# EAGLE board oresat-camera-card-v0 (EAGLE 9.6.1), part 1 of 3
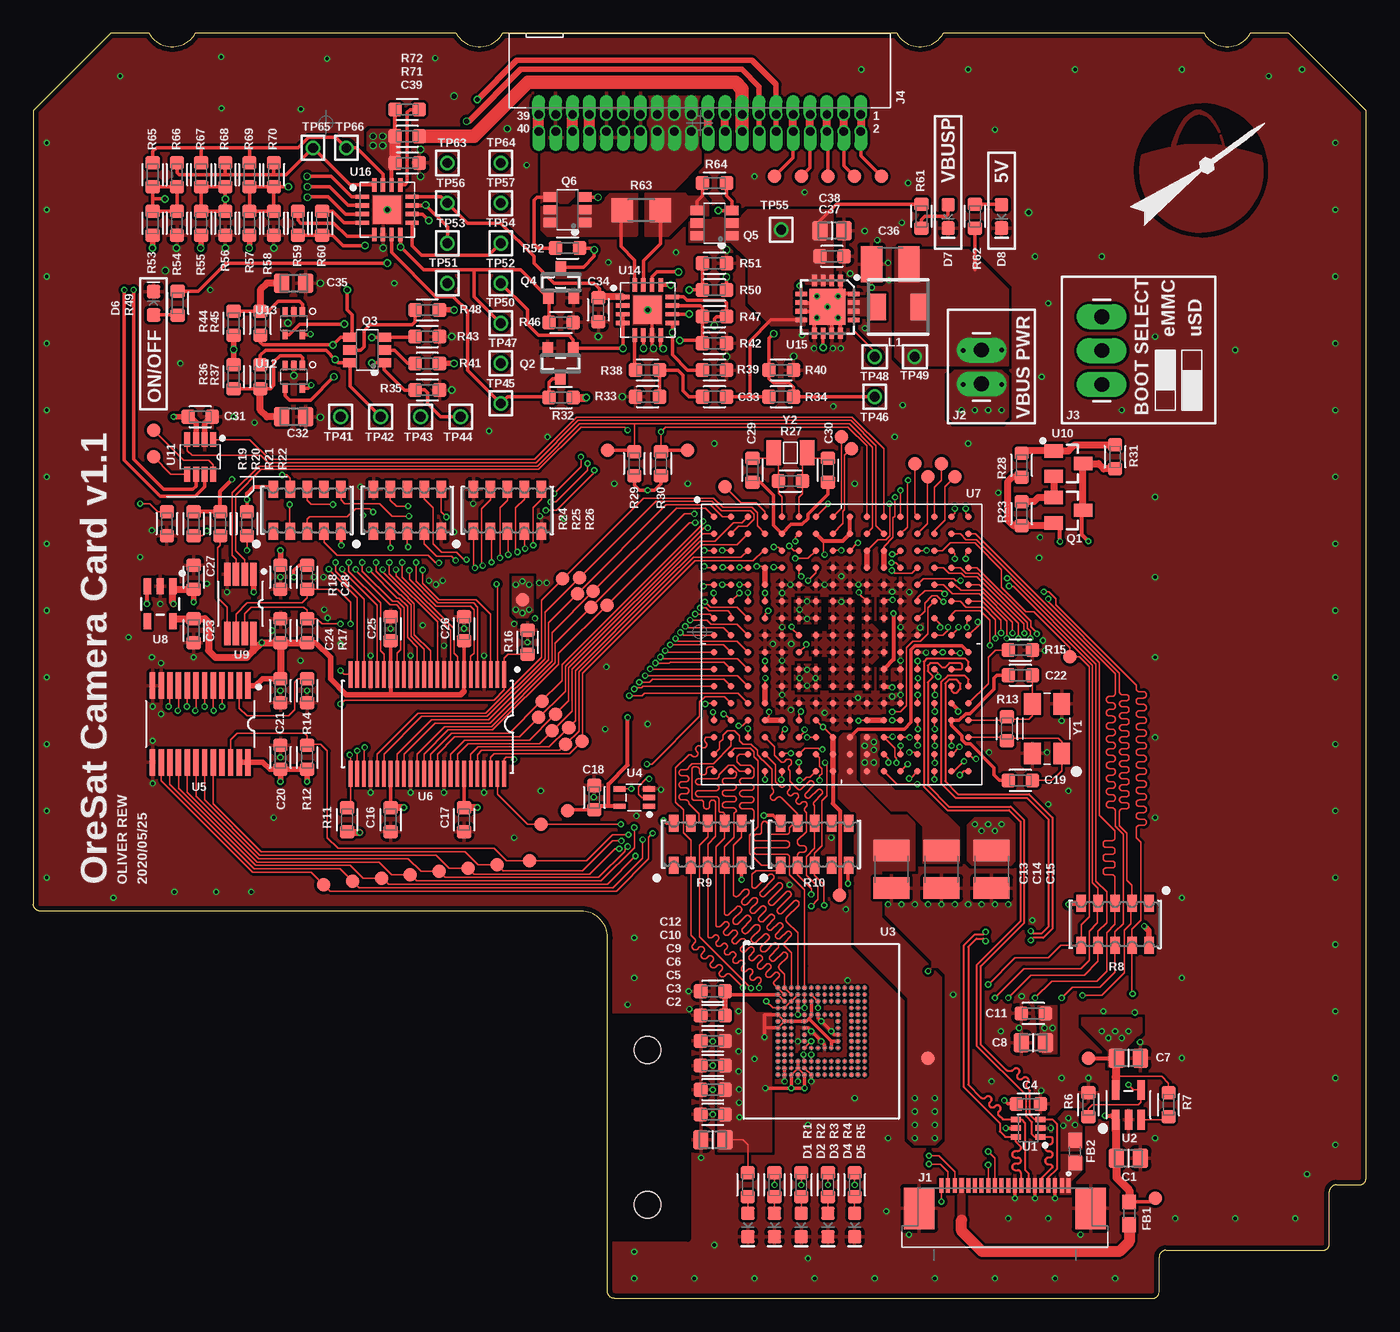
[diagram p9: board, top side]
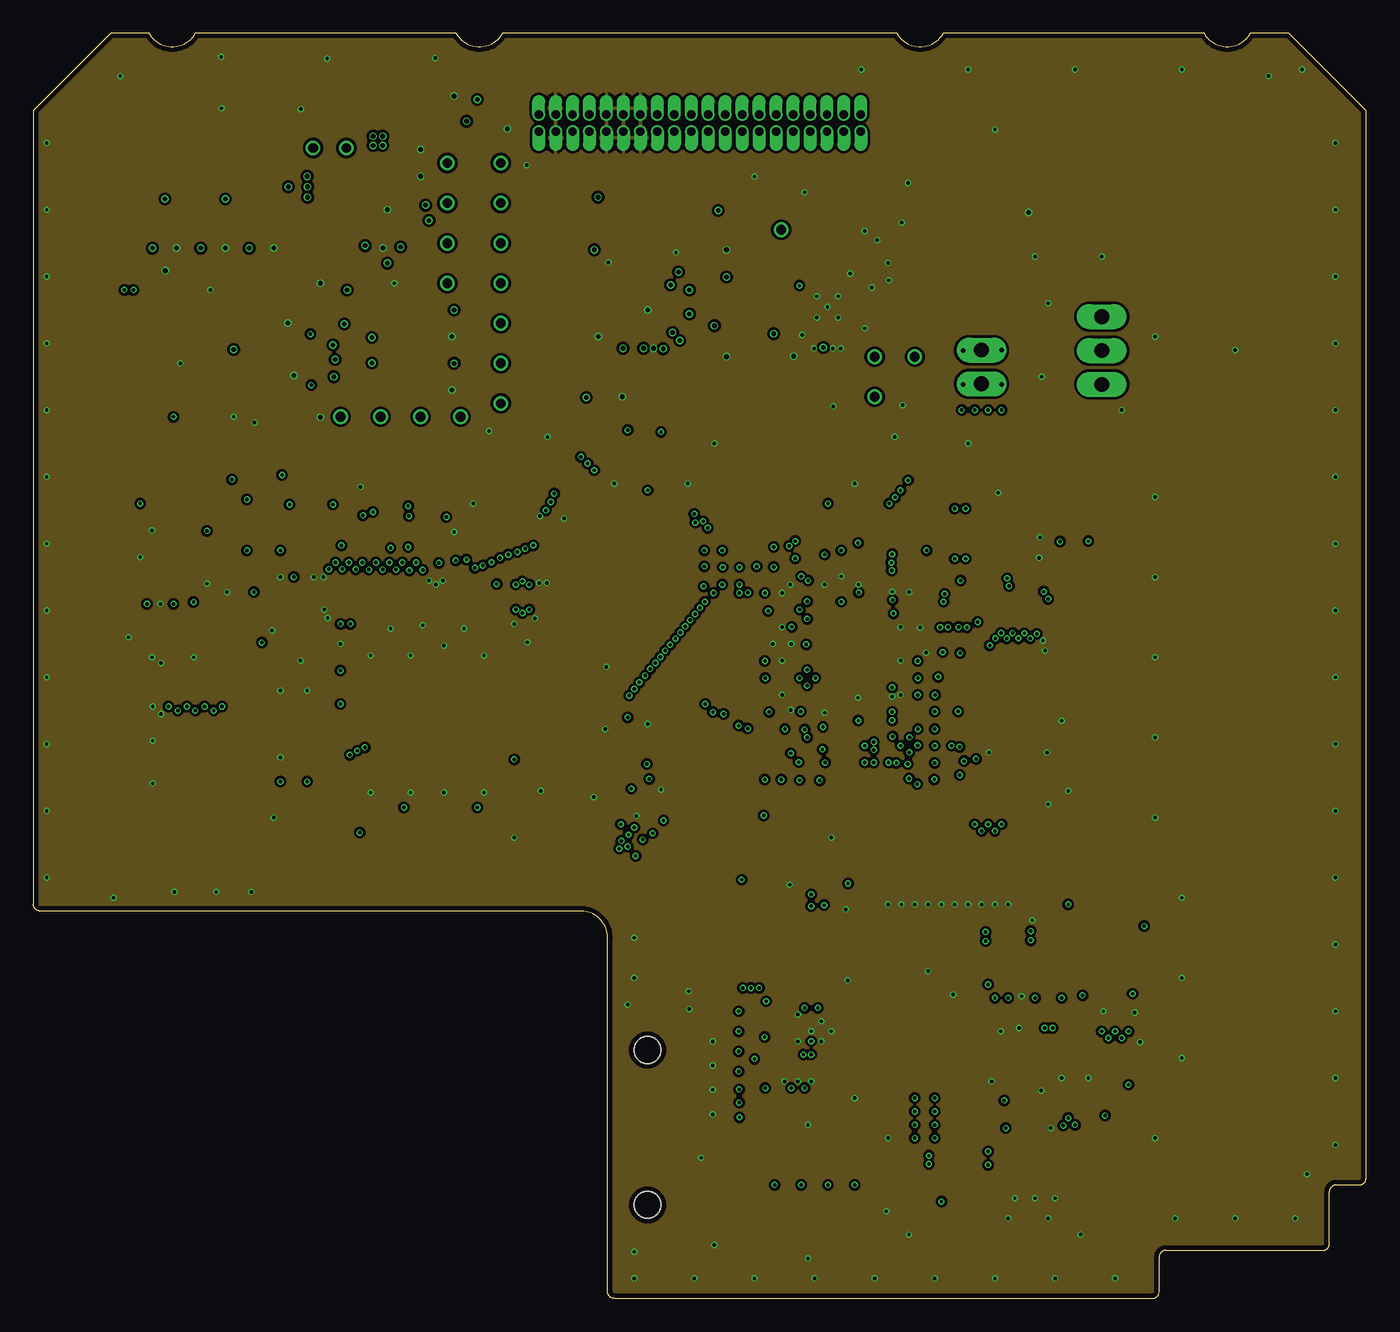
[diagram p10: board, inner layer Route2]
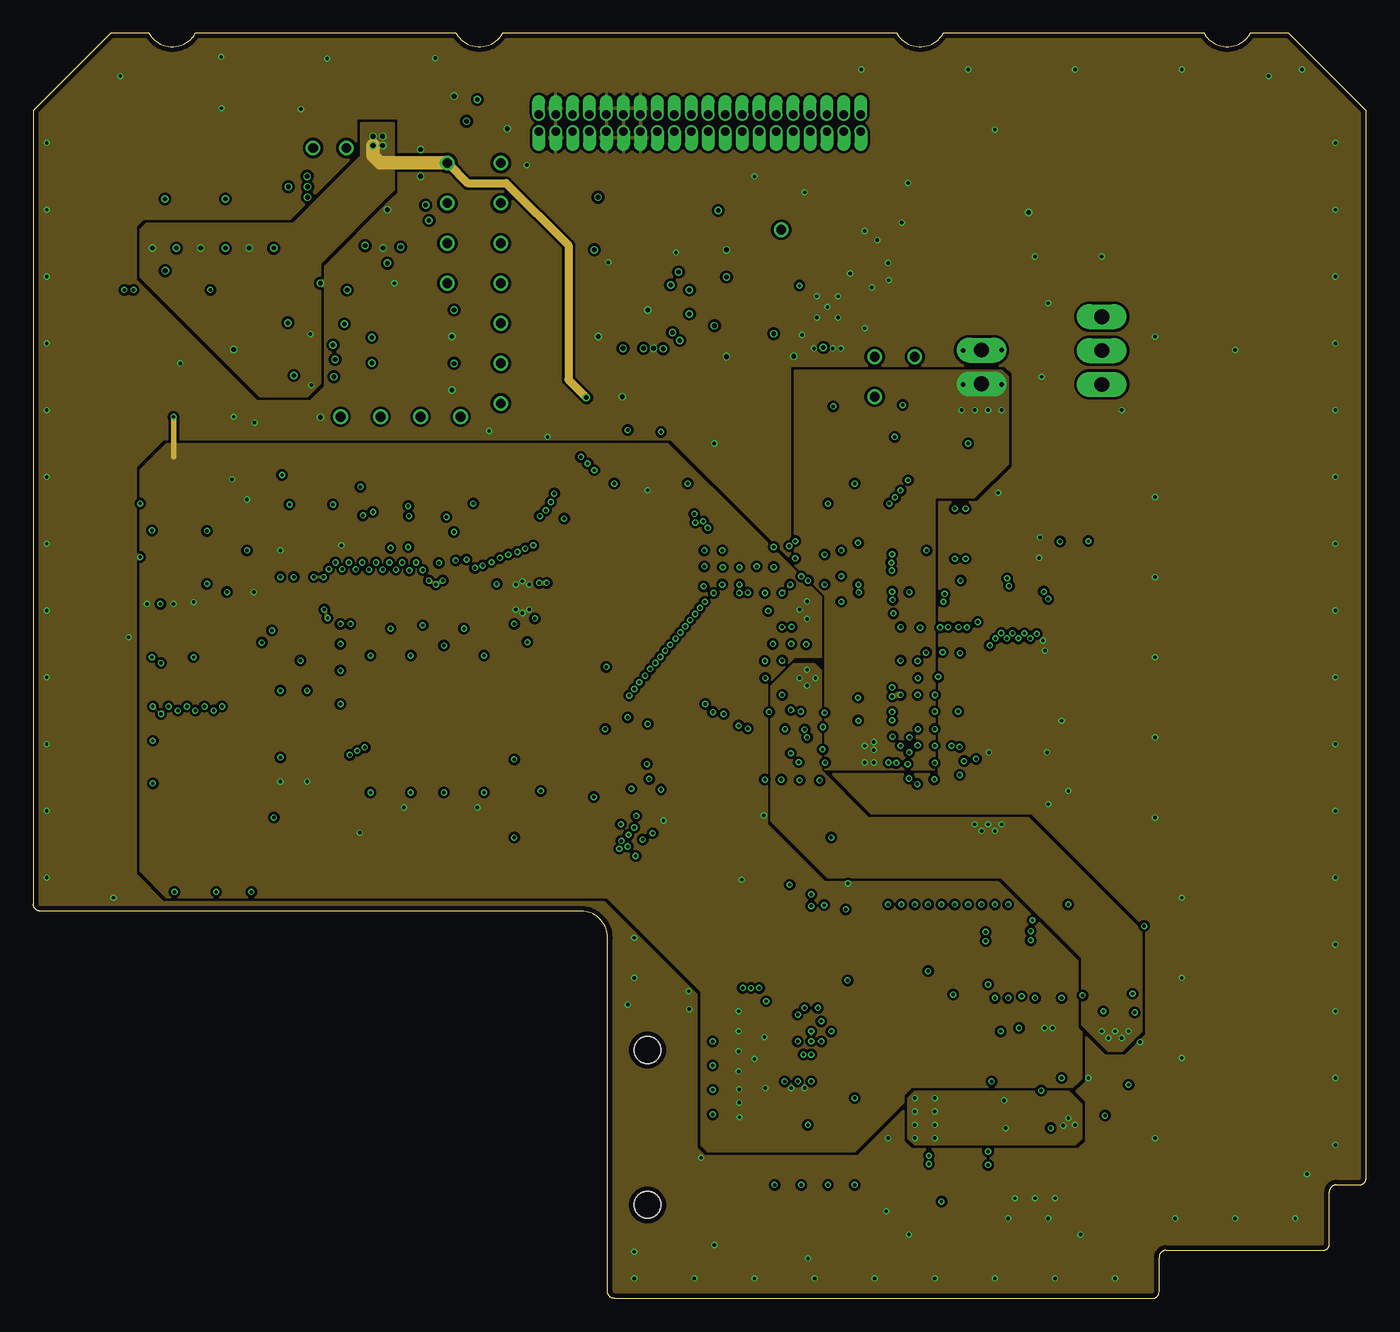
[diagram p11: board, inner layer Route15]
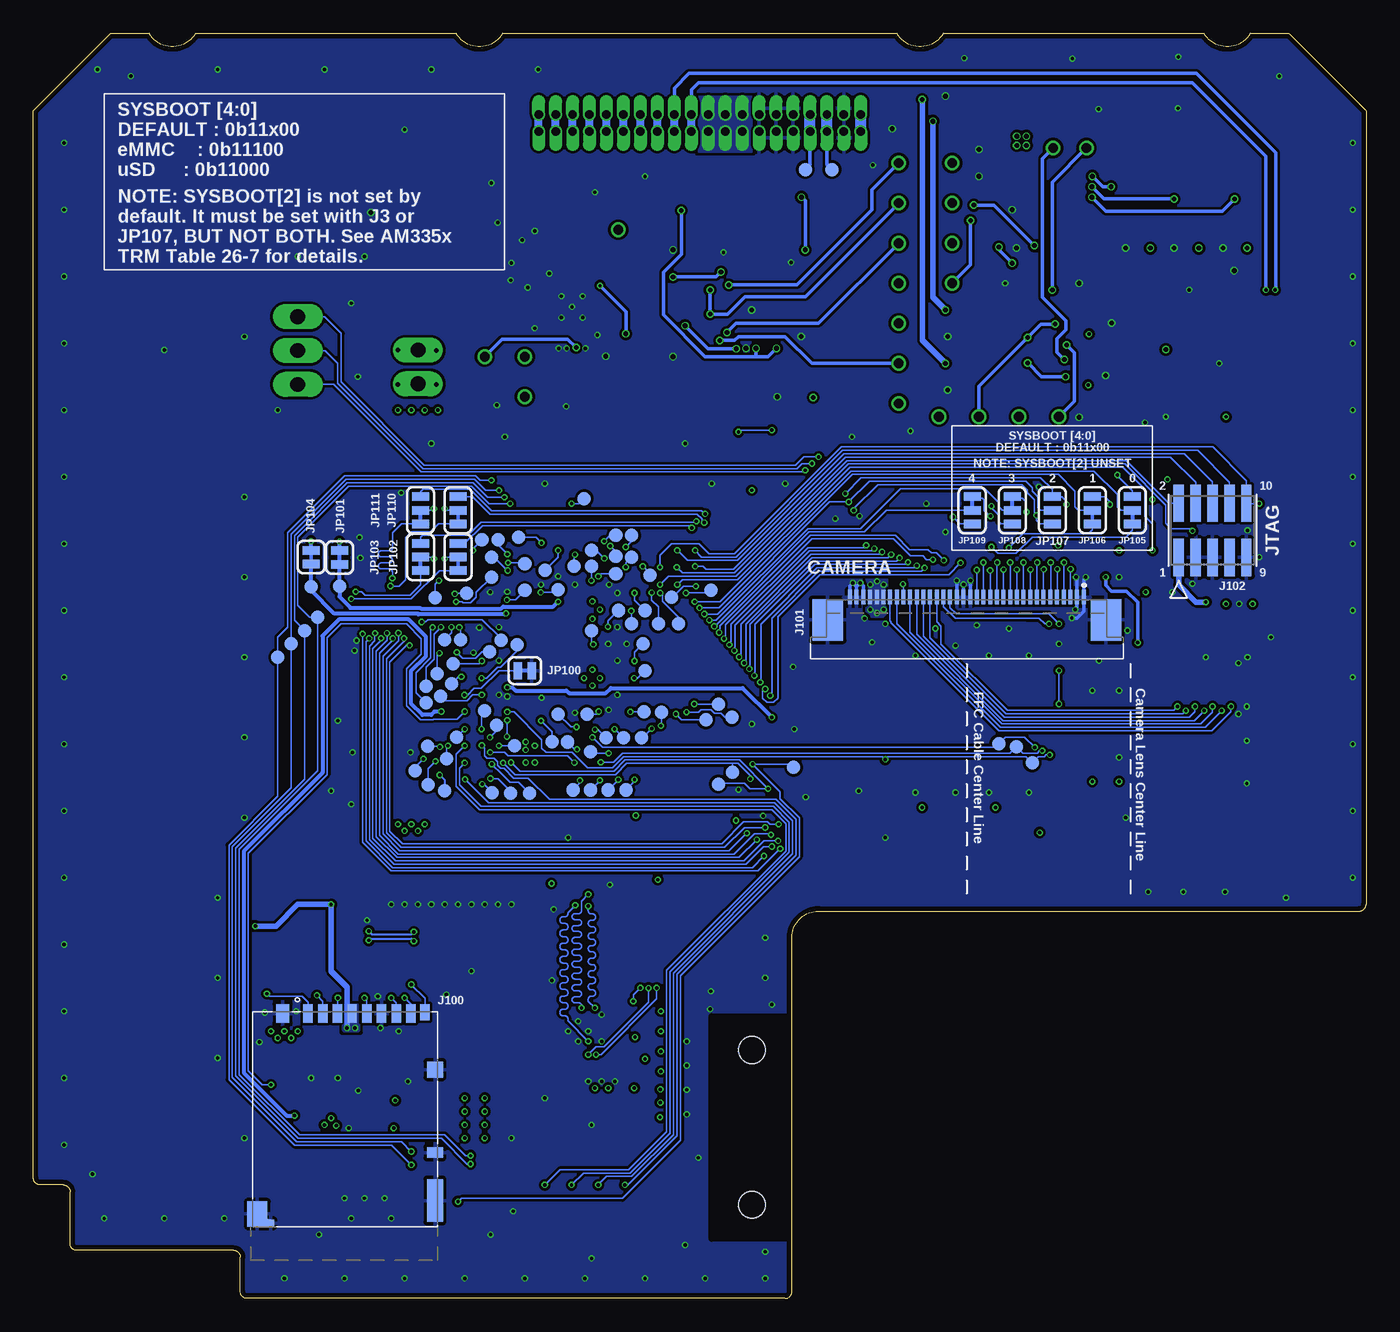
[diagram p12: board, bottom side, seen from below]

Size 99.8 x 94.7 mm. Coordinates in mm from the lower left corner, seen from the top.
Copper layers (1*2*15*16): Top 0.035559375mm / dielectric 0.17018125mm / Route2 0.01778125mm / dielectric 47mil / Route15 0.01778125mm / dielectric 0.17018125mm / Bottom 0.035559375mm
Design rules "4-layer_tented *": minimum track width 5mil, minimum drill 10mil, track to track 5mil, track to pad 5mil, pad to pad 5mil, via to via 5mil, smd to smd 5mil, copper to edge 15mil, drill to drill 6mil, minimum pad ring 4mil, minimum via ring 4mil, stop-mask expansion 2.5mil, vias tented up to drill 20mil, thermal gap 10mil
Net classes: 1 diff pair: width 0.191 mm, clearance 0.191 mm
Holes 2 mm at 46,7 46,18.6
tRestrict: area 43,4.5 to 49,21.1
bRestrict: area 43,4.5 to 49,21.1

## Footprints (pad centres in the part's own frame; a part is rotated, then mirrored left to right if it is on the bottom)
.0805-B = smd 1.15 x 1.45: 1 -0.9,0; 2 0.9,0
.0603-A = smd 1 x 1.05: 1 -0.9,0; 2 0.9,0
C1210 = smd 1.6 x 2.7: 1 -1.4,0; 2 1.4,0
.0805-B-NOSILK = smd 1.15 x 1.45: 1 -0.9,0; 2 0.9,0
LED-0603 = smd 1 x 1: A -0.877,0; C 0.877,0
0603 = smd 1.1 x 1: 1 -0.85,0; 2 0.85,0
TE_2-1734592-0 = smd 0.3 x 1.1: 1 -4.75,-1.7; 2 -4.25,-1.7; 3 -3.75,-1.7; 4 -3.25,-1.7; 5 -2.75,-1.7; 6 -2.25,-1.7; 7 -1.75,-1.7; 8 -1.25,-1.7; 9 -0.75,-1.7; 10 -0.25,-1.7; 11 0.25,-1.7; 12 0.75,-1.7; 13 1.25,-1.7; 14 1.75,-1.7; 15 2.25,-1.7; 16 2.75,-1.7; 17 3.25,-1.7; 18 3.75,-1.7; 19 4.25,-1.7; 20 4.75,-1.7 | smd 2.3 x 3.1: PAD1 6.42,0; PAD2 -6.42,0
1X02_LONGPADS = drill 1.118 pad 1.88 long: 1 0,0; 2 2.54,0
1X03_LONGPADS = drill 1.118 pad 1.88 long: 1 0,0; 2 2.54,0; 3 5.08,0
J-SAMTEC-TFM-120-X1-XXX-D-RA = drill 0.635 pad 0.965 offset: 1 12.065,0.635; 2 12.065,-0.635; 3 10.795,0.635; 4 10.795,-0.635; 5 9.525,0.635; 6 9.525,-0.635; 7 8.255,0.635; 8 8.255,-0.635; 9 6.985,0.635; 10 6.985,-0.635; 11 5.715,0.635; 12 5.715,-0.635; 13 4.445,0.635; 14 4.445,-0.635; 15 3.175,0.635; 16 3.175,-0.635; 17 1.905,0.635; 18 1.905,-0.635; 19 0.635,0.635; 20 0.635,-0.635; 21 -0.635,0.635; 22 -0.635,-0.635; 23 -1.905,0.635; 24 -1.905,-0.635; 25 -3.175,0.635; 26 -3.175,-0.635; 27 -4.445,0.635; 28 -4.445,-0.635; 29 -5.715,0.635; 30 -5.715,-0.635; 31 -6.985,0.635; 32 -6.985,-0.635; 33 -8.255,0.635; 34 -8.255,-0.635; 35 -9.525,0.635; 36 -9.525,-0.635; 37 -10.795,0.635; 38 -10.795,-0.635; 39 -12.065,0.635; 40 -12.065,-0.635
DM3BT-DSF-PEJS = smd 0.7 x 1.4: 1 -3.2,15.95; 2 -2.1,15.95; 3 -1,15.95; 4 0.1,15.95; 5 1.2,15.95; 6 2.3,15.95; 7 3.4,15.95; 8 4.5,15.95 | smd 0.7 x 1.2: CD 5.55,16.05 | smd 0.5 x 0.5: CGND1 -6,0.25 | smd 1.5 x 1.9: CGND2 -7,0.95 | smd 0.21 x 0.21 rotated 45: CGND3 -6.25,0.5 | smd 1 x 1.4: CGND4 -5.1,15.95 | smd 1.2 x 1.2: CGND5 6.3,11.75 | smd 1.2 x 3.2: CGND6 6.3,1.95 | smd 1.2 x 0.8: GND 6.3,5.55
TE_3-1734592-6 = smd 0.3 x 1.1: 1 -8.75,0; 2 -8.25,0; 3 -7.75,0; 4 -7.25,0; 5 -6.75,0; 6 -6.25,0; 7 -5.75,0; 8 -5.25,0; 9 -4.75,0; 10 -4.25,0; 11 -3.75,0; 12 -3.25,0; 13 -2.75,0; 14 -2.25,0; 15 -1.75,0; 16 -1.25,0; 17 -0.75,0; 18 -0.25,0; 19 0.25,0; 20 0.75,0; 21 1.25,0; 22 1.75,0; 23 2.25,0; 24 2.75,0; 25 3.25,0; 26 3.75,0; 27 4.25,0; 28 4.75,0; 29 5.25,0; 30 5.75,0; 31 6.25,0; 32 6.75,0; 33 7.25,0; 34 7.75,0; 35 8.25,0; 36 8.75,0 | smd 2.3 x 3.1: S1 10.42,1.7; S2 -10.42,1.7
CON10_2X5_DUK_FTSH = smd 0.762 x 2.794: 1 -2.54,-2.032; 2 -2.54,2.032; 3 -1.27,-2.032; 4 -1.27,2.032; 5 0,-2.032; 6 0,2.032; 7 1.27,-2.032; 8 1.27,2.032; 9 2.54,-2.032; 10 2.54,2.032
SMT-JUMPER_2_NC_TRACE_SILK = smd 0.635 x 1.27: 1 -0.508,0; 2 0.508,0
SMT-JUMPER_3_1-NC_TRACE_SILK = smd 0.635 x 1.27: 1 -1.016,0; 2 0,0; 3 1.016,0
SMT-JUMPER_3_0-NO_TRACE_NO-SILK = smd 0.635 x 1.27: 1 -1.016,0; 2 0,0; 3 1.016,0
ECS-MPI4040 = smd 2 x 1.3: 1 0,1.575; 2 0,-1.575
SOT23-BEC = smd 1 x 1.4: B -0.95,-1.1; C 0,1.1; E 0.95,-1.1
SOT23 = smd 0.787 x 0.889: 1 -0.953,-1.143; 2 0.953,-1.143; 3 0,1.143
SOT23-6 = smd 0.7 x 1: 1 -0.95,-1.3; 2 0,-1.3; 3 0.95,-1.3; 4 0.95,1.3; 5 0,1.3; 6 -0.95,1.3
ARRAY_EXBA-M = smd 1.27 x 0.711: 1 -1.575,2.54; 2 -1.575,1.27; 3 -1.575,0; 4 -1.575,-1.27; 5 -1.575,-2.54; 6 1.575,-2.54; 7 1.575,-1.27; 8 1.575,0; 9 1.575,1.27; 10 1.575,2.54
R1206 = smd 1.6 x 1.803: 1 -1.422,0; 2 1.422,0
PAD.03X.04 = smd 1.016 x 1.016: P$1 0,0
2MM-TEST-POINT = drill 0.737: 1 0,0
SC70-6 = smd 0.4 x 0.75: 1 -0.65,-0.925; 2 0,-0.925; 3 0.65,-0.925; 4 0.65,0.925; 5 0,0.925; 6 -0.65,0.925
DBV5 = smd 1.473 x 0.559: 1 -1.118,0.95; 2 -1.118,0; 3 -1.118,-0.95; 4 1.118,-0.95; 5 1.118,0.95
BGA-153(11.5X13)(EMMC-BA) = smd 0.28 x 0.28: A1 -3.25,3.25; A2 -2.75,3.25; A3 -2.25,3.25; A4 -1.75,3.25; A5 -1.25,3.25; A6 -0.75,3.25; A7 -0.25,3.25; A8 0.25,3.25; A9 0.75,3.25; A10 1.25,3.25; A11 1.75,3.25; A12 2.25,3.25; A13 2.75,3.25; A14 3.25,3.25; B1 -3.25,2.75; B2 -2.75,2.75; B3 -2.25,2.75; B4 -1.75,2.75; B5 -1.25,2.75; B6 -0.75,2.75; B7 -0.25,2.75; B8 0.25,2.75; B9 0.75,2.75; B10 1.25,2.75; B11 1.75,2.75; B12 2.25,2.75; B13 2.75,2.75; B14 3.25,2.75; C1 -3.25,2.25; C2 -2.75,2.25; C3 -2.25,2.25; C4 -1.75,2.25; C5 -1.25,2.25; C6 -0.75,2.25; C7 -0.25,2.25; C8 0.25,2.25; C9 0.75,2.25; C10 1.25,2.25; C11 1.75,2.25; C12 2.25,2.25; C13 2.75,2.25; C14 3.25,2.25; D1 -3.25,1.75; D2 -2.75,1.75; D3 -2.25,1.75; D4 -1.75,1.75; D12 2.25,1.75; D13 2.75,1.75; D14 3.25,1.75; E1 -3.25,1.25; E2 -2.75,1.25; E3 -2.25,1.25; E5 -1.25,1.25; E6 -0.75,1.25; E7 -0.25,1.25; E8 0.25,1.25; E9 0.75,1.25; E10 1.25,1.25; E12 2.25,1.25; E13 2.75,1.25; E14 3.25,1.25; F1 -3.25,0.75; F2 -2.75,0.75; F3 -2.25,0.75; F5 -1.25,0.75; F10 1.25,0.75; F12 2.25,0.75; F13 2.75,0.75; F14 3.25,0.75; G1 -3.25,0.25; G2 -2.75,0.25; G3 -2.25,0.25; G5 -1.25,0.25; G10 1.25,0.25; G12 2.25,0.25; G13 2.75,0.25; G14 3.25,0.25; H1 -3.25,-0.25; H2 -2.75,-0.25; H3 -2.25,-0.25; H5 -1.25,-0.25; H10 1.25,-0.25; H12 2.25,-0.25; H13 2.75,-0.25; H14 3.25,-0.25; J1 -3.25,-0.75; J2 -2.75,-0.75; J3 -2.25,-0.75; J5 -1.25,-0.75; J10 1.25,-0.75; J12 2.25,-0.75; J13 2.75,-0.75; J14 3.25,-0.75; K1 -3.25,-1.25; K2 -2.75,-1.25; K3 -2.25,-1.25; K5 -1.25,-1.25; K6 -0.75,-1.25; K7 -0.25,-1.25; K8 0.25,-1.25; K9 0.75,-1.25; K10 1.25,-1.25; K12 2.25,-1.25; K13 2.75,-1.25; K14 3.25,-1.25; L1 -3.25,-1.75; L2 -2.75,-1.75; L3 -2.25,-1.75; L12 2.25,-1.75; L13 2.75,-1.75; L14 3.25,-1.75; M1 -3.25,-2.25; M2 -2.75,-2.25; M3 -2.25,-2.25; M4 -1.75,-2.25; M5 -1.25,-2.25; M6 -0.75,-2.25; M7 -0.25,-2.25; M8 0.25,-2.25; M9 0.75,-2.25; M10 1.25,-2.25; M11 1.75,-2.25; M12 2.25,-2.25; M13 2.75,-2.25; M14 3.25,-2.25; N1 -3.25,-2.75; N2 -2.75,-2.75; N3 -2.25,-2.75; N4 -1.75,-2.75; N5 -1.25,-2.75; N6 -0.75,-2.75; N7 -0.25,-2.75; N8 0.25,-2.75; N9 0.75,-2.75; N10 1.25,-2.75; N11 1.75,-2.75; N12 2.25,-2.75; N13 2.75,-2.75; N14 3.25,-2.75; P1 -3.25,-3.25; P2 -2.75,-3.25; P3 -2.25,-3.25; P4 -1.75,-3.25; P5 -1.25,-3.25; P6 -0.75,-3.25; P7 -0.25,-3.25; P8 0.25,-3.25; P9 0.75,-3.25; P10 1.25,-3.25; P11 1.75,-3.25; P12 2.25,-3.25; P13 2.75,-3.25; P14 3.25,-3.25
C70(TI-DCK) = smd 0.4 x 0.9: 1 0.65,1.1; 2 0,1.1; 3 -0.65,1.1; 4 -0.65,-1.1; 5 0.65,-1.1
PW24-M = smd 1.981 x 0.406: 1 -2.87,3.575; 2 -2.87,2.925; 3 -2.87,2.275; 4 -2.87,1.625; 5 -2.87,0.975; 6 -2.87,0.325; 7 -2.87,-0.325; 8 -2.87,-0.975; 9 -2.87,-1.625; 10 -2.87,-2.275; 11 -2.87,-2.925; 12 -2.87,-3.575; 13 2.87,-3.575; 14 2.87,-2.925; 15 2.87,-2.275; 16 2.87,-1.625; 17 2.87,-0.975; 18 2.87,-0.325; 19 2.87,0.325; 20 2.87,0.975; 21 2.87,1.625; 22 2.87,2.275; 23 2.87,2.925; 24 2.87,3.575
DGG48-M = smd 1.981 x 0.279: 1 -3.721,5.75; 2 -3.721,5.25; 3 -3.721,4.75; 4 -3.721,4.25; 5 -3.721,3.75; 6 -3.721,3.25; 7 -3.721,2.75; 8 -3.721,2.25; 9 -3.721,1.75; 10 -3.721,1.25; 11 -3.721,0.75; 12 -3.721,0.25; 13 -3.721,-0.25; 14 -3.721,-0.75; 15 -3.721,-1.25; 16 -3.721,-1.75; 17 -3.721,-2.25; 18 -3.721,-2.75; 19 -3.721,-3.25; 20 -3.721,-3.75; 21 -3.721,-4.25; 22 -3.721,-4.75; 23 -3.721,-5.25; 24 -3.721,-5.75; 25 3.721,-5.75; 26 3.721,-5.25; 27 3.721,-4.75; 28 3.721,-4.25; 29 3.721,-3.75; 30 3.721,-3.25; 31 3.721,-2.75; 32 3.721,-2.25; 33 3.721,-1.75; 34 3.721,-1.25; 35 3.721,-0.75; 36 3.721,-0.25; 37 3.721,0.25; 38 3.721,0.75; 39 3.721,1.25; 40 3.721,1.75; 41 3.721,2.25; 42 3.721,2.75; 43 3.721,3.25; 44 3.721,3.75; 45 3.721,4.25; 46 3.721,4.75; 47 3.721,5.25; 48 3.721,5.75
OSD335X-BGA-256 = smd 0.5 x 0.5: A1 -9.525,-9.525; A2 -9.525,-8.255; A3 -9.525,-6.985; A4 -9.525,-5.715; A5 -9.525,-4.445; A6 -9.525,-3.175; A7 -9.525,-1.905; A8 -9.525,-0.635; A9 -9.525,0.635; A10 -9.525,1.905; A11 -9.525,3.175; A12 -9.525,4.445; A13 -9.525,5.715; A14 -9.525,6.985; A15 -9.525,8.255; A16 -9.525,9.525; B1 -8.255,-9.525; B2 -8.255,-8.255; B3 -8.255,-6.985; B4 -8.255,-5.715; B5 -8.255,-4.445; B6 -8.255,-3.175; B7 -8.255,-1.905; B8 -8.255,-0.635; B9 -8.255,0.635; B10 -8.255,1.905; B11 -8.255,3.175; B12 -8.255,4.445; B13 -8.255,5.715; B14 -8.255,6.985; B15 -8.255,8.255; B16 -8.255,9.525; C1 -6.985,-9.525; C2 -6.985,-8.255; C3 -6.985,-6.985; C4 -6.985,-5.715; C5 -6.985,-4.445; C6 -6.985,-3.175; C7 -6.985,-1.905; C8 -6.985,-0.635; C9 -6.985,0.635; C10 -6.985,1.905; C11 -6.985,3.175; C12 -6.985,4.445; C13 -6.985,5.715; C14 -6.985,6.985; C15 -6.985,8.255; C16 -6.985,9.525; D1 -5.715,-9.525; D2 -5.715,-8.255; D3 -5.715,-6.985; D4 -5.715,-5.715; D5 -5.715,-4.445; D6 -5.715,-3.175; D7 -5.715,-1.905; D8 -5.715,-0.635; D9 -5.715,0.635; D10 -5.715,1.905; D11 -5.715,3.175; D12 -5.715,4.445; D13 -5.715,5.715; D14 -5.715,6.985; D15 -5.715,8.255; D16 -5.715,9.525; E1 -4.445,-9.525; E2 -4.445,-8.255; E3 -4.445,-6.985; E4 -4.445,-5.715; E5 -4.445,-4.445; E6 -4.445,-3.175; E7 -4.445,-1.905; E8 -4.445,-0.635; E9 -4.445,0.635; E10 -4.445,1.905; E11 -4.445,3.175; E12 -4.445,4.445; E13 -4.445,5.715; E14 -4.445,6.985; E15 -4.445,8.255; E16 -4.445,9.525; F1 -3.175,-9.525; F2 -3.175,-8.255; F3 -3.175,-6.985; F4 -3.175,-5.715; F5 -3.175,-4.445; F6 -3.175,-3.175; F7 -3.175,-1.905; F8 -3.175,-0.635; F9 -3.175,0.635; F10 -3.175,1.905; F11 -3.175,3.175; F12 -3.175,4.445; F13 -3.175,5.715; F14 -3.175,6.985; F15 -3.175,8.255; F16 -3.175,9.525; G1 -1.905,-9.525; G2 -1.905,-8.255; G3 -1.905,-6.985; G4 -1.905,-5.715; G5 -1.905,-4.445; G6 -1.905,-3.175; G7 -1.905,-1.905; G8 -1.905,-0.635; G9 -1.905,0.635; G10 -1.905,1.905; G11 -1.905,3.175; G12 -1.905,4.445; G13 -1.905,5.715; G14 -1.905,6.985; G15 -1.905,8.255; G16 -1.905,9.525; H1 -0.635,-9.525; H2 -0.635,-8.255; H3 -0.635,-6.985; H4 -0.635,-5.715; H5 -0.635,-4.445; H6 -0.635,-3.175; H7 -0.635,-1.905; H8 -0.635,-0.635; H9 -0.635,0.635; H10 -0.635,1.905; H11 -0.635,3.175; H12 -0.635,4.445; H13 -0.635,5.715; H14 -0.635,6.985; H15 -0.635,8.255; H16 -0.635,9.525; J1 0.635,-9.525; J2 0.635,-8.255; J3 0.635,-6.985; J4 0.635,-5.715; J5 0.635,-4.445; J6 0.635,-3.175; J7 0.635,-1.905; J8 0.635,-0.635; J9 0.635,0.635; J10 0.635,1.905; J11 0.635,3.175; J12 0.635,4.445; J13 0.635,5.715; J14 0.635,6.985; J15 0.635,8.255; J16 0.635,9.525; K1 1.905,-9.525; K2 1.905,-8.255; K3 1.905,-6.985; K4 1.905,-5.715; K5 1.905,-4.445; K6 1.905,-3.175; K7 1.905,-1.905; K8 1.905,-0.635; K9 1.905,0.635; K10 1.905,1.905; K11 1.905,3.175; K12 1.905,4.445; K13 1.905,5.715; K14 1.905,6.985; K15 1.905,8.255; K16 1.905,9.525; L1 3.175,-9.525; L2 3.175,-8.255; L3 3.175,-6.985; L4 3.175,-5.715; L5 3.175,-4.445; L6 3.175,-3.175; L7 3.175,-1.905; L8 3.175,-0.635; L9 3.175,0.635; L10 3.175,1.905; L11 3.175,3.175; L12 3.175,4.445; L13 3.175,5.715; L14 3.175,6.985; L15 3.175,8.255; L16 3.175,9.525; M1 4.445,-9.525; M2 4.445,-8.255; M3 4.445,-6.985; M4 4.445,-5.715; M5 4.445,-4.445; M6 4.445,-3.175; M7 4.445,-1.905; M8 4.445,-0.635; M9 4.445,0.635; M10 4.445,1.905; M11 4.445,3.175; M12 4.445,4.445; M13 4.445,5.715; M14 4.445,6.985; M15 4.445,8.255; M16 4.445,9.525; N1 5.715,-9.525; N2 5.715,-8.255; N3 5.715,-6.985; N4 5.715,-5.715; N5 5.715,-4.445; N6 5.715,-3.175; N7 5.715,-1.905; N8 5.715,-0.635; N9 5.715,0.635; N10 5.715,1.905; N11 5.715,3.175; N12 5.715,4.445; N13 5.715,5.715; N14 5.715,6.985; N15 5.715,8.255; N16 5.715,9.525; P1 6.985,-9.525; P2 6.985,-8.255; P3 6.985,-6.985; P4 6.985,-5.715; P5 6.985,-4.445; P6 6.985,-3.175; P7 6.985,-1.905; P8 6.985,-0.635; P9 6.985,0.635; P10 6.985,1.905; P11 6.985,3.175; P12 6.985,4.445; P13 6.985,5.715; P14 6.985,6.985; P15 6.985,8.255; P16 6.985,9.525; R1 8.255,-9.525; R2 8.255,-8.255; R3 8.255,-6.985; R4 8.255,-5.715; R5 8.255,-4.445; R6 8.255,-3.175; R7 8.255,-1.905; R8 8.255,-0.635; R9 8.255,0.635; R10 8.255,1.905; R11 8.255,3.175; R12 8.255,4.445; R13 8.255,5.715; R14 8.255,6.985; R15 8.255,8.255; R16 8.255,9.525; T1 9.525,-9.525; T2 9.525,-8.255; T3 9.525,-6.985; T4 9.525,-5.715; T5 9.525,-4.445; T6 9.525,-3.175; T7 9.525,-1.905; T8 9.525,-0.635; T9 9.525,0.635; T10 9.525,1.905; T11 9.525,3.175; T12 9.525,4.445; T13 9.525,5.715; T14 9.525,6.985; T15 9.525,8.255; T16 9.525,9.525
SOT23-5 = smd 0.55 x 1.2: 1 -0.95,-1.3; 2 0,-1.3; 3 0.95,-1.3; 4 0.95,1.3; 5 -0.95,1.3
DGK8-M = smd 1.727 x 0.483: 1 -2.223,0.975; 2 -2.223,0.325; 3 -2.223,-0.325; 4 -2.223,-0.975; 5 2.223,-0.975; 6 2.223,-0.325; 7 2.223,0.325; 8 2.223,0.975
SOT23-3 = smd 1 x 1.4: 1 -0.95,-1.1; 2 0.95,-1.1; 3 0,1.1
SOT23-8_TI-DCN = smd 0.45 x 1.1: 1 -0.975,-1.3; 2 -0.325,-1.3; 3 0.325,-1.3; 4 0.975,-1.3; 5 0.975,1.3; 6 0.325,1.3; 7 -0.325,1.3; 8 -0.975,1.3
SC70-5 = smd 0.4 x 0.7: 1 -0.65,-0.85; 2 0,-0.85; 3 0.65,-0.85; 4 0.65,0.85; 5 -0.65,0.85
QFN65P400X400X80-17T210 = smd 1.01 x 0.32: 1 -1.86,0.975; 2 -1.86,0.325; 3 -1.86,-0.325; 4 -1.86,-0.975; 9 1.86,-0.975; 10 1.86,-0.325; 11 1.86,0.325; 12 1.86,0.975 | smd 0.32 x 1.01: 5 -0.975,-1.86; 6 -0.325,-1.86; 7 0.325,-1.86; 8 0.975,-1.86; 13 0.975,1.86; 14 0.325,1.86; 15 -0.325,1.86; 16 -0.975,1.86 | smd 2.1 x 2.1: EPAD 0,0
S-PVQFN-16 = smd 0.85 x 0.35: 1 -1.975,0.975; 2 -1.975,0.325; 3 -1.975,-0.325; 4 -1.975,-0.975; 9 1.975,-0.975; 10 1.975,-0.325; 11 1.975,0.325; 12 1.975,0.975 | smd 0.35 x 0.85: 5 -0.975,-1.975; 6 -0.325,-1.975; 7 0.325,-1.975; 8 0.975,-1.975; 13 0.975,1.975; 14 0.325,1.975; 15 -0.325,1.975; 16 -0.975,1.975 | smd 2.7 x 2.7: PAD 0,0
5X3.2-4SMD = smd 1.6 x 1.25: 1 -1.85,-1.1; 2 1.85,-1.1; 3 1.85,1.1; 4 -1.85,1.1
CRYSTAL_3.2X1.5 = smd 1.1 x 1.9: P$1 -1.25,0; P$2 1.25,0

## Placement (x,y rotation side)
C1  10uF  [.0805-B]  82,10.5 0 top
C2  10uF  [.0805-B]  50.88,11.88 180 top
C3  1uF  [.0603-A]  50.88,13.78 180 top
C4  0.1uF  [.0603-A]  74.5,14.56 0 top
C5  1uF  [.0603-A]  50.88,15.62 180 top
C6  1uF  [.0603-A]  50.88,17.44 180 top
C7  10uF  [.0805-B]  82,18 0 top
C8  10uF  [.0805-B]  74.88,19.16 180 top
C9  1uF  [.0603-A]  50.88,19.28 180 top
C10  1uF  [.0603-A]  50.88,21.19 180 top
C11  0.1uF  [.0603-A]  74.88,21.34 180 top
C12  1uF  [.0603-A]  50.88,23 180 top
C13  22uF  [C1210]  64.25,32.12 270 top
C14  22uF  [C1210]  68,32.12 270 top
C15  22uF  [C1210]  71.75,32.12 270 top
C16  0.1uF  [.0603-A]  26.75,35.84 270 top
C17  0.1uF  [.0603-A]  32.25,35.84 270 top
C18  0.1uF, 6.3V  [.0603-A]  42,37.5 90 top
C19  18pF, 50V  [.0603-A]  73.91,38.78 0 top
C20  0.1uF  [.0603-A]  18.5,40.5 90 top
C21  0.1uF  [.0603-A]  18.5,45.5 270 top
C22  18pF, 50V  [.0603-A]  73.91,46.66 0 top
C23  1uF  [.0603-A]  12,50 270 top
C24  0.1uF  [.0603-A]  18.5,50 90 top
C25  0.1uF  [.0603-A]  26.75,50.12 90 top
C26  0.1uF  [.0603-A]  32.25,50.12 90 top
C27  1uF  [.0603-A]  12,54 90 top
C28  0.1uF  [.0603-A]  18.5,54 270 top
C29  18pF, 50V  [.0603-A]  53.84,62 270 top
C30  18pF, 50V  [.0603-A]  59.5,62 270 top
C31  0.1uF  [.0603-A]  12.5,66 180 top
C32  1u  [.0805-B-NOSILK]  19.5,66 0 top
C33  NP  [.0603-A]  51,67.5 0 top
C34  1uF  [.0603-A]  42.31,74 270 top
C35  1u  [.0805-B-NOSILK]  19.5,76 0 top
C36  22uF  [C1210]  64.16,77.42 180 top
C37  1uF  [.0603-A]  59.8,78.01 0 top
C38  10uF  [.0805-B]  59.79,79.94 0 top
C39  0.1uF  [.0603-A]  28,85 180 top
D1  GREEN  [LED-0603]  53.5,5.5 270 top
D2  BLUE  [LED-0603]  55.5,5.5 270 top
D3  BLUE  [LED-0603]  57.5,5.5 270 top
D4  BLUE  [LED-0603]  59.5,5.5 270 top
D5  BLUE  [LED-0603]  61.5,5.5 270 top
D6  AMBER  [LED-0603]  9,74.5 90 top
D7  GREEN  [LED-0603]  68.5,81 270 top
D8  GREEN  [LED-0603]  72.5,81 270 top
FB1  30Ω/1.8A  [0603]  82.06,6.38 270 top
FB2  30Ω/1.8A  [0603]  78,11 90 top
J1  ORESAT-DEBUG-CONNECTOR-CARD  [TE_2-1734592-0]  72.75,6.75 180 top
J2  [1X02_LONGPADS]  71,71 270 top
J3  [1X03_LONGPADS]  80,73.5 270 top
J4  TFM-120-01-L-D-RA  [J-SAMTEC-TFM-120-X1-XXX-D-RA]  49.9,87.99 0 top
J100  DM3BT-DSF-PEJS  [DM3BT-DSF-PEJS]  76.03,5.38 0 bottom
J101  3-1734592-64-1734592-0  [TE_3-1734592-6]  29.9,52.5 180 bottom
J102  FTSH-105-XX-X-DV-K  [CON10_2X5_DUK_FTSH]  11.5,57.5 0 bottom
JP100  JUMPER-SMT_2_NC_TRACE_SILK  [SMT-JUMPER_2_NC_TRACE_SILK]  63,47 0 bottom
JP101  JUMPER-SMT_2_NC_TRACE_SILK  [SMT-JUMPER_2_NC_TRACE_SILK]  76.88,55.47 90 bottom
JP102  JUMPER-SMT_3_1-NC_TRACE_SILK  [SMT-JUMPER_3_1-NC_TRACE_SILK]  68,55.5 270 bottom
JP103  JUMPER-SMT_3_1-NC_TRACE_SILK  [SMT-JUMPER_3_1-NC_TRACE_SILK]  70.81,55.5 270 bottom
JP104  JUMPER-SMT_2_NC_TRACE_SILK  [SMT-JUMPER_2_NC_TRACE_SILK]  79,55.5 90 bottom
JP105  JUMPER-SMT_3_1-NC_TRACE_SILK  [SMT-JUMPER_3_1-NC_TRACE_SILK]  17.5,59 270 bottom
JP106  JUMPER-SMT_3_1-NC_TRACE_SILK  [SMT-JUMPER_3_1-NC_TRACE_SILK]  20.5,59 270 bottom
JP107  JUMPER-SMT_3_NO_NO_SILK  [SMT-JUMPER_3_0-NO_TRACE_NO-SILK]  23.5,59 270 bottom
JP108  JUMPER-SMT_3_1-NC_TRACE_SILK  [SMT-JUMPER_3_1-NC_TRACE_SILK]  26.5,59 90 bottom
JP109  JUMPER-SMT_3_1-NC_TRACE_SILK  [SMT-JUMPER_3_1-NC_TRACE_SILK]  29.5,59 90 bottom
JP110  JUMPER-SMT_3_1-NC_TRACE_SILK  [SMT-JUMPER_3_1-NC_TRACE_SILK]  68,59 270 bottom
JP111  JUMPER-SMT_3_1-NC_TRACE_SILK  [SMT-JUMPER_3_1-NC_TRACE_SILK]  70.81,59 270 bottom
L1  6.8u  [ECS-MPI4040]  64.76,74.22 90 top
Q1  MMBT2907  [SOT23-BEC]  77.5,59 270 top
Q2  PMV45EN  [SOT23]  39.47,70 180 top
Q3  DMP2240UDM  [SOT23-6]  25,71 90 top
Q4  PMV45EN  [SOT23]  39.5,76.06 0 top
Q5  MOSFET-PCH-SOT23-6  [SOT23-6]  51,80.5 90 top
Q6  MOSFET-PCH-SOT23-6  [SOT23-6]  40,81.5 90 top
R1  1k  [.0603-A]  53.5,8.5 270 top
R2  1k  [.0603-A]  55.5,8.5 270 top
R3  1k  [.0603-A]  57.5,8.5 270 top
R4  1k  [.0603-A]  59.5,8.5 270 top
R5  1k  [.0603-A]  61.5,8.5 270 top
R6  10k  [.0603-A]  79,14.5 270 top
R7  10k  [.0603-A]  85,14.5 90 top
R8  10K  [ARRAY_EXBA-M]  81,28 270 top
R9  10K  [ARRAY_EXBA-M]  50.5,34 90 top
R10  10K  [ARRAY_EXBA-M]  58.5,34 90 top
R11  10k  [.0603-A]  23.5,35.84 270 top
R12  10k  [.0603-A]  20.5,40.5 270 top
R13  1M, 1%  [.0603-A]  72.91,42.66 270 top
R14  10k  [.0603-A]  20.5,45.5 270 top
R15  10k  [.0603-A]  73.91,48.53 180 top
R16  10k  [.0603-A]  37,49.12 90 top
R17  4.7k  [.0603-A]  20.5,50 90 top
R18  4.7k  [.0603-A]  20.5,54 270 top
R19  10k  [.0603-A]  10,58 90 top
R20  10k  [.0603-A]  12,58 90 top
R21  10k  [.0603-A]  14,58 90 top
R22  10k  [.0603-A]  16,58 90 top
R23  499  [.0603-A]  74,58.75 270 top
R24  100K  [ARRAY_EXBA-M]  20.5,59 90 top
R25  100K  [ARRAY_EXBA-M]  28,59 90 top
R26  100K  [ARRAY_EXBA-M]  35.5,59 90 top
R27  1M, DNI  [.0603-A]  56.69,61.19 0 top
R28  10.0K  [.0603-A]  74,62.38 270 top
R29  4.7k  [.0603-A]  45,62.5 90 top
R30  4.7k  [.0603-A]  47,62.5 90 top
R31  40.2K  [.0603-A]  81,63 90 top
R32  10k  [.0603-A]  39.5,67.44 0 top
R33  NP  [.0603-A]  46,67.5 0 top
R34  10k  [.0603-A]  56,67.5 180 top
R35  10k  [.0603-A]  29.5,68 180 top
R36  1M  [.0603-A]  15,69 90 top
R37  330k  [.0603-A]  17,69 90 top
R38  NP  [.0603-A]  46,69.5 0 top
R39  10k  [.0603-A]  51,69.5 180 top
R40  NP  [.0603-A]  56,69.5 180 top
R41  100  [.0603-A]  29.5,70 180 top
R42  NP  [.0603-A]  51,71.5 180 top
R43  10k  [.0603-A]  29.5,72 180 top
R44  1M  [.0603-A]  15,73 270 top
R45  330k  [.0603-A]  17,73 270 top
R46  10k  [.0603-A]  39.5,73.06 180 top
R47  0  [.0603-A]  51,73.5 0 top
R48  100  [.0603-A]  29.5,74 180 top
R49  2.7k  [.0603-A]  10.81,74.5 90 top
R50  0  [.0603-A]  51,75.5 0 top
R51  NP  [.0603-A]  51,77.5 180 top
R52  10k  [.0603-A]  40,78.62 180 top
R53  NP  [.0603-A]  8.94,80.5 270 top
R54  NP  [.0603-A]  10.75,80.5 90 top
R55  NP  [.0603-A]  12.56,80.5 270 top
R56  NP  [.0603-A]  14.38,80.5 90 top
R57  NP  [.0603-A]  16.19,80.5 270 top
R58  NP  [.0603-A]  18,80.5 90 top
R59  47k  [.0603-A]  19.81,80.5 90 top
R60  47k  [.0603-A]  21.62,80.5 90 top
R61  2.7k  [.0603-A]  66.5,81 90 top
R62  2.7k  [.0603-A]  70.5,81 270 top
R63  100m  [R1206]  45.53,81.47 0 top
R64  10k  [.0603-A]  51,83.5 180 top
R65  NP  [.0603-A]  8.94,84.12 270 top
R66  NP  [.0603-A]  10.75,84.12 90 top
R67  NP  [.0603-A]  12.56,84.12 270 top
R68  NP  [.0603-A]  14.38,84.12 90 top
R69  NP  [.0603-A]  16.19,84.12 270 top
R70  NP  [.0603-A]  18,84.12 90 top
R71  100  [.0603-A]  28,87 180 top
R72  10k  [.0603-A]  28,89 180 top
TP1  TEST-POINT3X4  [PAD.03X.04]  84,7.5 0 top
TP2  TEST-POINT3X4  [PAD.03X.04]  67,18 90 top
TP3  TEST-POINT3X4  [PAD.03X.04]  79,18 90 top
TP4  TEST-POINT3X4  [PAD.03X.04]  60.34,30.19 90 top
TP5  TEST-POINT3X4  [PAD.03X.04]  21.73,30.97 0 top
TP6  TEST-POINT3X4  [PAD.03X.04]  23.91,31.22 0 top
TP7  TEST-POINT3X4  [PAD.03X.04]  26.06,31.47 0 top
TP8  TEST-POINT3X4  [PAD.03X.04]  28.22,31.72 0 top
TP9  TEST-POINT3X4  [PAD.03X.04]  30.38,31.97 0 top
TP10  TEST-POINT3X4  [PAD.03X.04]  32.56,32.22 0 top
TP11  TEST-POINT3X4  [PAD.03X.04]  34.72,32.47 0 top
TP12  TEST-POINT3X4  [PAD.03X.04]  37.16,32.75 0 top
TP13  TEST-POINT3X4  [PAD.03X.04]  38,35.5 0 top
TP14  TEST-POINT3X4  [PAD.03X.04]  40,36.5 90 top
TP15  TEST-POINT3X4  [PAD.03X.04]  39.84,41.5 0 top
TP16  TEST-POINT3X4  [PAD.03X.04]  41.09,41.72 0 top
TP17  TEST-POINT3X4  [PAD.03X.04]  38.84,42.5 0 top
TP18  TEST-POINT3X4  [PAD.03X.04]  40.09,42.72 0 top
TP19  TEST-POINT3X4  [PAD.03X.04]  37.84,43.5 0 top
TP20  TEST-POINT3X4  [PAD.03X.04]  39.09,43.72 0 top
TP21  TEST-POINT3X4  [PAD.03X.04]  38.09,44.72 0 top
TP22  TEST-POINT3X4  [PAD.03X.04]  77.62,48.03 0 top
TP23  TEST-POINT3X4  [PAD.03X.04]  41.75,51.75 0 top
TP24  TEST-POINT3X4  [PAD.03X.04]  42.95,51.89 0 top
TP25  TEST-POINT3X4  [PAD.03X.04]  36.62,52.31 0 top
TP26  TEST-POINT3X4  [PAD.03X.04]  40.73,52.77 0 top
TP27  TEST-POINT3X4  [PAD.03X.04]  41.91,52.94 0 top
TP28  TEST-POINT3X4  [PAD.03X.04]  39.64,53.86 0 top
TP29  TEST-POINT3X4  [PAD.03X.04]  40.89,53.95 0 top
TP30  TEST-POINT3X4  [PAD.03X.04]  51.78,60.78 0 top
TP31  TEST-POINT3X4  [PAD.03X.04]  67,61.5 0 top
TP32  TEST-POINT3X4  [PAD.03X.04]  69,61.5 0 top
TP33  TEST-POINT3X4  [PAD.03X.04]  66,62.5 0 top
TP34  TEST-POINT3X4  [PAD.03X.04]  68,62.5 0 top
TP35  TEST-POINT3X4  [PAD.03X.04]  9,63 0 top
TP36  TEST-POINT3X4  [PAD.03X.04]  43,63.5 0 top
TP37  TEST-POINT3X4  [PAD.03X.04]  49,63.5 270 top
TP38  TEST-POINT3X4  [PAD.03X.04]  61.25,63.62 0 top
TP39  TEST-POINT3X4  [PAD.03X.04]  60.5,64.5 0 top
TP40  TEST-POINT3X4  [PAD.03X.04]  9,65 0 top
TP41  TEST-POINT  [2MM-TEST-POINT]  23,66 0 top
TP42  TEST-POINT  [2MM-TEST-POINT]  26,66 0 top
TP43  TEST-POINT  [2MM-TEST-POINT]  29,66 0 top
TP44  TEST-POINT  [2MM-TEST-POINT]  32,66 0 top
TP45  TEST-POINT  [2MM-TEST-POINT]  35,67 0 top
TP46  TEST-POINT  [2MM-TEST-POINT]  63,67.5 0 top
TP47  TEST-POINT  [2MM-TEST-POINT]  35,70 0 top
TP48  TEST-POINT  [2MM-TEST-POINT]  63,70.5 270 top
TP49  TEST-POINT  [2MM-TEST-POINT]  66,70.5 270 top
TP50  TEST-POINT  [2MM-TEST-POINT]  35,73 0 top
TP51  TEST-POINT  [2MM-TEST-POINT]  31,76 0 top
TP52  TEST-POINT  [2MM-TEST-POINT]  35,76 0 top
TP53  TEST-POINT  [2MM-TEST-POINT]  31,79 0 top
TP54  TEST-POINT  [2MM-TEST-POINT]  35,79 0 top
TP55  TEST-POINT  [2MM-TEST-POINT]  56,80 0 top
TP56  TEST-POINT  [2MM-TEST-POINT]  31,82 0 top
TP57  TEST-POINT  [2MM-TEST-POINT]  35,82 0 top
TP58  TEST-POINT3X4  [PAD.03X.04]  55.5,84 270 top
TP59  TEST-POINT3X4  [PAD.03X.04]  57.5,84 270 top
TP60  TEST-POINT3X4  [PAD.03X.04]  59.5,84 270 top
TP61  TEST-POINT3X4  [PAD.03X.04]  61.5,84 270 top
TP62  TEST-POINT3X4  [PAD.03X.04]  63.5,84 270 top
TP63  TEST-POINT  [2MM-TEST-POINT]  31,85 0 top
TP64  TEST-POINT  [2MM-TEST-POINT]  35,85 0 top
TP65  TEST-POINT  [2MM-TEST-POINT]  20.94,86.12 0 top
TP66  TEST-POINT  [2MM-TEST-POINT]  23.44,86.12 0 top
TP100  TEST-POINT3X4  [PAD.03X.04]  62.66,37.81 0 bottom
TP101  TEST-POINT3X4  [PAD.03X.04]  64.06,37.81 0 bottom
TP102  TEST-POINT3X4  [PAD.03X.04]  65.44,37.88 0 bottom
TP103  TEST-POINT3X4  [PAD.03X.04]  69,38 0 bottom
TP104  TEST-POINT3X4  [PAD.03X.04]  55.44,38.06 0 bottom
TP105  TEST-POINT3X4  [PAD.03X.04]  56.75,38.06 0 bottom
TP106  TEST-POINT3X4  [PAD.03X.04]  58.06,38.06 0 bottom
TP107  TEST-POINT3X4  [PAD.03X.04]  59.41,38.06 0 bottom
TP108  TEST-POINT3X4  [PAD.03X.04]  70.25,38.47 0 bottom
TP109  TEST-POINT3X4  [PAD.03X.04]  48.5,38.5 0 bottom
TP110  TEST-POINT3X4  [PAD.03X.04]  47.44,39.38 0 bottom
TP111  TEST-POINT3X4  [PAD.03X.04]  71.22,39.5 0 bottom
TP112  TEST-POINT3X4  [PAD.03X.04]  42.88,39.75 270 bottom
TP113  TEST-POINT3X4  [PAD.03X.04]  25,40.09 0 bottom
TP114  TEST-POINT3X4  [PAD.03X.04]  68.84,40.41 0 bottom
TP115  TEST-POINT3X4  [PAD.03X.04]  58.09,40.94 0 bottom
TP116  TEST-POINT3X4  [PAD.03X.04]  26.19,41.31 0 bottom
TP117  TEST-POINT3X4  [PAD.03X.04]  70.28,41.34 0 bottom
TP118  TEST-POINT3X4  [PAD.03X.04]  63.78,41.38 0 bottom
TP119  TEST-POINT3X4  [PAD.03X.04]  27.5,41.53 0 bottom
TP120  TEST-POINT3X4  [PAD.03X.04]  59.81,41.66 0 bottom
TP121  TEST-POINT3X4  [PAD.03X.04]  60.97,41.69 90 bottom
TP122  TEST-POINT3X4  [PAD.03X.04]  54.25,41.97 0 bottom
TP123  TEST-POINT3X4  [PAD.03X.04]  55.59,41.97 0 bottom
TP124  TEST-POINT3X4  [PAD.03X.04]  56.91,41.97 0 bottom
TP125  TEST-POINT3X4  [PAD.03X.04]  68.12,42 0 bottom
TP126  TEST-POINT3X4  [PAD.03X.04]  65.12,42.91 0 bottom
TP127  TEST-POINT3X4  [PAD.03X.04]  49.44,43.31 0 bottom
TP128  TEST-POINT3X4  [PAD.03X.04]  47.5,43.5 0 bottom
TP129  TEST-POINT3X4  [PAD.03X.04]  58.34,43.75 90 bottom
TP130  TEST-POINT3X4  [PAD.03X.04]  60.5,43.75 90 bottom
TP131  TEST-POINT3X4  [PAD.03X.04]  52.78,43.88 0 bottom
TP132  TEST-POINT3X4  [PAD.03X.04]  54.06,43.94 90 bottom
TP133  TEST-POINT3X4  [PAD.03X.04]  66,44 90 bottom
TP134  TEST-POINT3X4  [PAD.03X.04]  48.5,44.5 0 bottom
TP135  TEST-POINT3X4  [PAD.03X.04]  70.41,44.59 0 bottom
TP136  TEST-POINT3X4  [PAD.03X.04]  69.31,45.09 90 bottom
TP137  TEST-POINT3X4  [PAD.03X.04]  70.41,45.81 0 bottom
TP138  TEST-POINT3X4  [PAD.03X.04]  68.5,46 0 bottom
TP139  TEST-POINT3X4  [PAD.03X.04]  69.56,46.78 0 bottom
TP140  TEST-POINT3X4  [PAD.03X.04]  54,47 90 bottom
TP141  TEST-POINT3X4  [PAD.03X.04]  68.38,47.5 0 bottom
TP142  TEST-POINT3X4  [PAD.03X.04]  81.5,48 0 bottom
TP143  TEST-POINT3X4  [PAD.03X.04]  65.66,48.41 0 bottom
TP144  TEST-POINT3X4  [PAD.03X.04]  63.56,48.94 0 bottom
TP145  TEST-POINT3X4  [PAD.03X.04]  54.16,49 0 bottom
TP146  TEST-POINT3X4  [PAD.03X.04]  80.5,49 0 bottom
TP147  TEST-POINT3X4  [PAD.03X.04]  64.78,49.28 0 bottom
TP148  TEST-POINT3X4  [PAD.03X.04]  67.81,49.31 0 bottom
TP149  TEST-POINT3X4  [PAD.03X.04]  69,49.31 0 bottom
TP150  TEST-POINT3X4  [PAD.03X.04]  58,50 0 bottom
TP151  TEST-POINT3X4  [PAD.03X.04]  79.5,50 90 bottom
TP152  TEST-POINT3X4  [PAD.03X.04]  51.5,50.5 0 bottom
TP153  TEST-POINT3X4  [PAD.03X.04]  53,50.5 0 bottom
TP154  TEST-POINT3X4  [PAD.03X.04]  55,50.5 0 bottom
TP155  TEST-POINT3X4  [PAD.03X.04]  78.5,51 90 bottom
TP156  TEST-POINT3X4  [PAD.03X.04]  54,51.5 0 bottom
TP157  TEST-POINT3X4  [PAD.03X.04]  56,51.5 0 bottom
TP158  TEST-POINT3X4  [PAD.03X.04]  69.72,52.44 0 bottom
TP159  TEST-POINT3X4  [PAD.03X.04]  52,52.5 0 bottom
TP160  TEST-POINT3X4  [PAD.03X.04]  67.34,52.78 0 bottom
TP161  TEST-POINT3X4  [PAD.03X.04]  63,53 90 bottom
TP162  TEST-POINT3X4  [PAD.03X.04]  49.06,53.03 0 bottom
TP163  TEST-POINT3X4  [PAD.03X.04]  60.5,53.06 90 bottom
TP164  TEST-POINT3X4  [PAD.03X.04]  79,53.28 90 bottom
TP165  TEST-POINT3X4  [PAD.03X.04]  76.88,53.31 90 bottom
TP166  TEST-POINT3X4  [PAD.03X.04]  65.5,54 0 bottom
TP167  TEST-POINT3X4  [PAD.03X.04]  53.62,54.12 90 bottom
TP168  TEST-POINT3X4  [PAD.03X.04]  56.19,54.25 0 bottom
TP169  TEST-POINT3X4  [PAD.03X.04]  61.5,54.5 0 bottom
TP170  TEST-POINT3X4  [PAD.03X.04]  58,54.81 0 bottom
TP171  TEST-POINT3X4  [PAD.03X.04]  59.31,54.81 0 bottom
TP172  TEST-POINT3X4  [PAD.03X.04]  63,55 0 bottom
TP173  TEST-POINT3X4  [PAD.03X.04]  55,55.5 0 bottom
TP174  TEST-POINT3X4  [PAD.03X.04]  65.5,55.5 0 bottom
TP175  TEST-POINT3X4  [PAD.03X.04]  56.19,55.56 0 bottom
TP176  TEST-POINT3X4  [PAD.03X.04]  58,56 0 bottom
TP177  TEST-POINT3X4  [PAD.03X.04]  65,56.78 0 bottom
TP178  TEST-POINT3X4  [PAD.03X.04]  66.22,56.78 0 bottom
TP179  TEST-POINT3X4  [PAD.03X.04]  63.47,56.97 0 bottom
TP180  TEST-POINT3X4  [PAD.03X.04]  55,57.12 0 bottom
TP181  TEST-POINT3X4  [PAD.03X.04]  56.19,57.12 0 bottom
TP182  TEST-POINT3X4  [PAD.03X.04]  58.56,59.88 0 bottom
TP183  TEST-POINT3X4  [PAD.03X.04]  40,84.5 0 bottom
TP184  TEST-POINT3X4  [PAD.03X.04]  42,84.5 0 bottom
U1  RCLAMP0504FB  [SC70-6]  74.5,12.75 90 top
U2  TPS2051CDBVR  [DBV5]  82,14.5 90 top
U3  [BGA-153(11.5X13)(EMMC-BA)]  59,20 0 top
U4  SN74LVC1G07DCK  [C70(TI-DCK)]  45,37.5 270 top
U5  SN74LVC8T245MPWREPPW24-M  [PW24-M]  12.5,43 270 top
U6  CLVCH16T245MDGGREP  [DGG48-M]  29.5,43 270 top
U7  OSD3358-512M-BSM  [OSD335X-BGA-256]  60.5,49 270 top
U8  TLV70028QDDCRQ1  [SOT23-5]  9.5,52 180 top
U9  TCA9509DGKRDGK8-M  [DGK8-M]  15.5,52 270 top
U10  TLVH431  [SOT23-3]  77.5,62.5 270 top
U11  TCAN330  [SOT23-8_TI-DCN]  12.5,63 180 top
U12  MIC842LYC5  [SC70-5]  19.5,69 180 top
U13  MIC842LYC5  [SC70-5]  19.5,73 180 top
U14  MAX4211FETE  [QFN65P400X400X80-17T210]  46,74 0 top
U15  TPS62112  [S-PVQFN-16]  59.46,74.22 270 top
U16  MAX7310ATE  [QFN65P400X400X80-17T210]  26.5,81.5 0 top
U$1  [ORESAT-CAMERA-CARD-V0.1-3XRF]  0,0 0 top
U$2  [CAMERA_BOARD_TOP_DIMS]  10.65,20.1 0 top
U$3  [PSAS_LOGO_10X10]  87.5,84.5 0 top
Y1  24MHz  [5X3.2-4SMD]  75.91,42.66 90 top
Y2  ABS07-32.768KHZ-T  [CRYSTAL_3.2X1.5]  56.69,63.31 0 top

## Tracks (layer width: path | path; a pad name or v marks a point on that pad's centre or on a via)
2.8V  (via drill 0.25)
  Top 0.254: C25.1 U6.18 | U6.7 C26.1 | R18.1 19.9,54.9 19.5,54.5 v19.5,54
  Top 0.305: 32.25,45.44 U6.7 | U6.18 26.75,45.19
  Top 0.406: U5.1 16.62,45.87 17.15,46.4 C21.1 | 32.25,45.44 32,45.19 26.75,45.19 23.44,45.19 22.25,46.37 22.25,48 21.15,49.1 R17.1
  Top 0.508: U8.5 10.65,50.9 C23.1 12.85,50.9 13.12,50.62 13.12,48.5 13.62,48 16,48 15.97,48.02 16.02,48.02 16.48,48.48 | U9.8 16.48,48.48 | C24.1 v17.1,49.1 16.48,48.48 | C24.1 R17.1 | C24.1 C21.1
  Bottom 0.254: v19.5,54 19.5,53.38 19.06,52.94 17.94,52.94 17.1,52.1 v17.1,49.1
3.3V  (via drill 0.25)
  Top 0.127: R1.1 53.5,11.5 53.12,11.88 C2.1
  Top 0.152: 55.75,21.25 56.25,20.75 55.75,20.25 | U3.P5 U3.N4 U3.P3
  Top 0.254: U3.C6 U3.E6 58.25,21.12 58.06,20.94 | 58.06,20.94 57.88,20.75 U3.F5 56.25,20.75 | 55.75,21.25 54.75,21.25 v54.75,19.56 54.75,20.25 55.75,20.25 | U3.K9 59.75,19.25 | U3.J10 59.75,19.25 | 59.75,19.25 58.06,20.94 | U3.M4 U3.N4 | U3.P3 v56.75,15.75 | U3.P5 v57.75,15.75 v56.75,15.75 | U6.42 32.25,37 C17.1 | U6.31 C16.1 | R9.10 47.39,35.58 v47.19,35.78 | R9.5 53.04,31.35 v53.03,31.34 | v54.69,36.16 55.38,36.16 R10.10 | R10.5 61,32.38 v61,31.06 | v54.81,15.75 v56.75,15.75 | R24.5 23.04,56.4 v23.06,56.38 | R29.1 45,60.88 45.38,60.5 v46,60.5 46.5,60.5 47,61 R30.1 | R22.2 v16,59.81
  Top 0.305: R20.2 R21.2 14,60.44 v14.88,61.31 | U8.3 8.5,53.25 v8.5,52 | v16,59.81 16,60.25 16.5,60.75 17.79,60.75 R24.10
  Top 0.406: v77.5,29.5 77.58,29.57 R8.5 | R8.10 83.54,27.52 v83.19,27.88 | U5.23 U5.24 17.18,40.13 17.71,39.6 C20.1 | C20.1 R12.2 v20.5,38.69 | U9.1 16.5,54.2 v16.5,52.88 | C27.1 v12,52.12 | C20.1 v18.5,38.69 | C28.1 v18.5,56 | U11.3 12.18,65.58 11.75,66 C31.2 v10.5,66
  Top 0.508: v24.44,34.88 23.57,34.88 R11.2 | v27.75,36.75 C16.1 | v33.25,36.75 32.5,36.75 32.25,37 | v10.5,52 10.45,52.05 U8.1 10.65,53.1 C27.1
  Route15 0.406: v10.5,66 10.5,63
  Bottom 0.406: v76.31,20.25 76.31,23.31 77.5,24.5 v77.5,29.5 80,29.5 81.62,27.88 v83.19,27.88 | J102.1 14.04,53.41 12.75,52.12 v12,52.12
  other vias: 52.88,13.56 52.81,17 52.81,18.5 52.81,20 52.81,21.5 54,17.94 36.12,53.44 37.12,53.44 36.62,53.69 36.12,51.56 37.12,51.56 36.62,51.31 57.38,51.56 57.94,52.19 57.94,50.88 52.84,15.66 52.84,14.66 75.72,20.25
  pour Top (isolate 0.2, no thermals): 51.31,22.12 53.38,22.12 54.12,21.38 55.25,21.38 55.25,11 51.31,11
  pour Top: 57,52.31 57,50.75 57.19,50.56 58.75,50.56 58.94,50.75 58.94,52.31 58.75,52.5 57.19,52.5
  pour Route15 (isolate 0.2): 59,52.5 59,48 57,48 54.97,45.97 54.97,32.97 53,31 49,31 48,32 48,58.5 49,59.5 52,59.5
  pour Bottom (isolate 0.2, no thermals): 35.88,54 35.88,51.31 36.19,51 37,51 37.41,51.41 37.41,54
  pour Bottom (no thermals): 75.47,22.03 75.47,20.56 75.38,20.47 75.38,20.09 75.5,19.97 76.53,19.97 76.62,20.06 76.66,20.09 76.66,20.34 76.66,20.44 76.53,20.56 76.53,22.03
  pour Top (no thermals): 75.22,21.91 75.56,18.31 76.66,18.31 76.66,21.91
  pour Route15 (isolate 0.2, no thermals): 54,57.5 47.5,64 10,64 8,62 8,32 10,30 52,30 54,32
  pour Top (isolate 0.2, no thermals): 35.88,54 35.88,51.31 36.19,51 37,51 37.41,51.41 37.41,54
  pour Route15 (isolate 0.2, rank 5): 43,38 53,38 59.5,31.5 72.5,31.5 78.5,25.5 78.5,16.5 77.5,15.5 66,15.5 61.5,11 50.5,11 50,11.5 50,23 43,30
5V  (via drill 0.35)
  Top 0.254: U15.10 59.14,71.21 v59.16,71.19 | R62.2 70.5,77
  Bottom 0.254: v59.16,71.19 59.78,71.81 64.69,71.81 TP49.1
  other vias: 72.5,71 69.62,70.97
  pour Top (isolate 0.2, no thermals): 64.5,78.5 70,78.5 73,75.5 73,69.81 65.19,69.81 64.5,70.5
5V_IN  (via drill 0.25, 0.35)
  other vias: 62.25,40.12 62.94,40.12 62.25,41.38 62.94,41.66 62.94,41.06 72.5,68.41 69.62,68.41 72.5,66.5 71.5,66.5 70.5,66.5 69.5,66.5
  pour Top (isolate 0.2, no thermals): 62.94,42.31 62.12,42.31 61.97,42.16 61.97,38.78 64.25,36.5 65.47,36.5 66.62,35.34 66.62,32.59 69.34,32.59 69.34,35.25 66.59,38 64.5,38 63.31,39.19 63.31,41.94
  pour Route15 (isolate 0.2): 59.28,39.59 67.5,39.59 67.5,68 57,67.96 57,54.92 59.28,52.66
  pour Route15 (isolate 0.2, no thermals): 72.5,69.5 57,69.5 57,59.94 70.44,59.94 73,62.5 73,69
  pour Top (no thermals): 72.5,69.5 73,69 73,66 72.5,65.5 69,65.5 68.5,66 68.5,69 69,69.5
!FAULT
  Top 0.254: Q2.3 38.89,68.86 38.6,68.57 R32.1 38.54,67.5 35.5,67.5 TP45.1 32.5,69.5 32.5,73.94 31.44,75 30.12,75 26.82,78.3 U16.7
!OE_E  (via drill 0.25)
  Top 0.127: v12.12,44 12.18,44.05 U5.7
  Bottom 0.127: J101.26 33.65,49.73 27.18,43.26 12.86,43.26 v12.12,44
!RESET_E  (via drill 0.25)
  Top 0.127: v13.5,44 13.47,44.02 U5.5
  Bottom 0.127: J101.24 32.65,50.35 32.67,50.33 32.67,49.47 26.97,43.77 13.73,43.77 v13.5,44
!SD
  Top 0.813: J4.40 J4.39
  Bottom 0.813: J4.40 J4.39
AD0  (via drill 0.35)
  Top 0.254: R70.1 R69.2 R57.1 R58.2 R70.1 | v20.5,84 22.31,84 23.84,82.47 U16.1 | v19.09,83.22 R70.1
  Bottom 0.254: v20.5,84 19.72,83.22 v19.09,83.22
AD1  (via drill 0.35)
  Top 0.254: U16.2 23.58,81.83 22.19,83.22 v20.53,83.22 | R55.1 R67.2 R68.1 v14.38,82.31 R56.2 R55.1
  Bottom 0.254: v20.53,83.22 19.62,82.31 v14.38,82.31
AD2  (via drill 0.35)
  Top 0.254: 8.94,82.31 R53.1 R54.2 R66.1 R65.2 8.94,82.31 | U16.3 23.36,81.17 22.07,82.47 20.56,82.47 v20.53,82.44 | v9.84,82.31 8.94,82.31
  Bottom 0.254: v20.53,82.44 19.49,81.4 R54.2 v9.84,82.31
BOOT0  (via drill 0.35)
  Top 0.254: U16.10 29.14,81.17 v29.62,80.69
  Bottom 0.254: TP51.1 29.62,77.38 v29.62,80.69
BUS_OE  (via drill 0.25)
  Top 0.127: R11.1 23.75,36.99 U6.25 23.75,40.62 v23.69,40.69 | U6.48 35.25,40.37 35.41,40.52 35.84,40.52 v36,40.36 | U7.F14 67,51.69 67,49.75 66.44,49.19 65.88,49.19 65.39,48.7 65.39,44.38 64.92,43.91 v64.31,43.91
  Bottom 0.127: v23.69,40.69 23.97,40.69 24.09,40.56 24.53,40.56 TP113.P$1 25.47,40.56 35.79,40.56 v36,40.36 36.21,40.56 55.59,40.56 56.44,39.72 58.3,39.72 59.46,40.88 61.41,40.88 61.73,41.2 61.73,41.83 63.81,43.91 v64.31,43.91
CAM_OE  (via drill 0.25)
  Top 0.127: U7.F15 69.4,52.17 69.84,51.73 71.13,51.73 72.04,50.82 v72.04,49.42 | v45,35.25 45,33.74 42.52,31.26 28.68,31.26 TP8.P$1 26.83,31.72 25.88,32.67 16.75,32.67 11.53,37.9 U5.17
  Bottom 0.127: v72.04,49.42 72.04,49.21 73.36,47.89 73.36,34.88 72.26,33.78 48.03,33.78 46.56,35.25 v45,35.25
CAN1_H
  Top 0.813: J4.34 J4.33
  Bottom 0.254: TP184.P$1 41.65,84.86 J4.34
  Bottom 0.813: J4.34 J4.33
CAN1_L
  Top 0.813: J4.36 J4.35
  Bottom 0.254: TP183.P$1 40.38,84.88 J4.36
  Bottom 0.813: J4.36 J4.35
CAN2_H  (via drill 0.25)
  Top 0.254: U11.7 12.82,60.76 12.12,60.06 9.5,60.06 6.81,62.75 v6.81,75.5
  Top 0.61: J4.18 J4.17
  Bottom 0.254: J4.17 51.8,90.6 50.69,91.72 12.72,91.72 6.78,85.78 6.78,75.53 v6.81,75.5
  Bottom 0.61: J4.18 J4.17
CAN2_L  (via drill 0.25)
  Top 0.254: U11.6 12.18,60.8 11.94,60.56 9.75,60.56 7.5,62.81 v7.5,75.5
  Top 0.61: J4.20 J4.19
  Bottom 0.254: J4.19 50.53,90.47 50,91 13,91 7.5,85.5 v7.5,75.5
  Bottom 0.61: J4.20 J4.19
CB-RESET  (via drill 0.35)
  Top 0.254: R39.2 49,69.5 47.86,70.64 v47.86,72.31 U14.9 | U16.9 28.36,78.8 29.06,78.09 34.09,78.09 TP54.1
  Bottom 0.254: v47.86,72.31 47.17,73 41,73 TP54.1
CB_CTRL  (via drill 0.35)
  Top 0.254: U14.6 45.67,71.14 v45.69,71.12 | 44.14,71.14 v44.16,71.12 | v51.28,81.44 52.29,81.44 Q5.3 52.3,82.14 51.9,82.54 R64.1 | 44.14,71.14 Q2.1 40.42,71.77 40.09,72.09 37.84,72.09 37,72.94 37,74 TP52.1 | 44.14,71.14 U14.4 U14.3
  Bottom 0.254: v44.16,71.12 44.78,70.5 45.69,70.5 | v51.28,81.44 51.28,78.16 52.62,76.81 52.62,73.62 49.5,70.5 45.69,70.5 | v45.69,71.12 45.69,70.5
CLK_EN  (via drill 0.25)
  Top 0.127: U7.E16 70.86,53.45 73.76,50.54 v73.76,49.42 | v44.03,34.26 43.38,34.26 41.14,32.02 35.17,32.02 TP11.P$1 33.3,32.47 32.34,33.43 17.07,33.43 13.47,37.02 U5.20
  Bottom 0.127: v73.76,49.42 73.76,49.27 74.38,48.65 74.38,34.46 72.68,32.76 46.59,32.76 45.09,34.26 v44.03,34.26
CLK_EN_E  (via drill 0.25)
  Top 0.127: v14.12,44.31 U5.4
  Bottom 0.127: J101.23 32.15,50.65 31.83,50.33 31.83,48.99 26.87,44.02 14.41,44.02 v14.12,44.31
D0_E  (via drill 0.25)
  Top 0.127: U6.11 30.25,50.66 26.66,54.25 v26.66,55.09
  Bottom 0.127: J101.12 v26.65,55.09 v26.66,55.09
D0_I  (via drill 0.25)
  Top 0.127: U6.38 30.25,40.75 31.55,42.05 36.42,42.05 37.69,43.31 | 37.69,43.31 39.84,45.46 39.84,47.32 50.2,57.69 v50.5,57.69 | TP19.P$1 37.69,43.31
  Bottom 0.127: JP102.1 67.5,56.52 66.17,57.84 50.66,57.84 v50.5,57.69
D1_E  (via drill 0.25)
  Top 0.127: U6.12 29.75,48.47 28.53,49.69 28.53,52.02 27.61,52.94 26.16,54.39 v26.16,54.56
  Bottom 0.127: J101.11 v26.15,54.56 v26.16,54.56
D1_I  (via drill 0.25)
  Top 0.127: U6.37 29.75,40.75 31.3,42.3 35.65,42.3 37.92,44.58 | 37.92,44.58 39.58,46.24 39.58,47.43 50.16,58 v50.16,58.18 | TP21.P$1 37.92,44.58
  Bottom 0.127: JP103.1 70.81,56.97 70.64,57.15 67.23,57.15 66.28,58.1 50.68,58.1 50.67,58.1 50.23,58.1 v50.16,58.18
D2_E  (via drill 0.25)
  Top 0.127: U6.13 29.25,48.61 28.27,49.59 28.27,51.92 27.5,52.69 27.41,52.69 25.66,54.44 v25.66,55.09
  Bottom 0.127: J101.10 v25.65,55.09 v25.66,55.09
D2_I  (via drill 0.25)
  Top 0.127: U6.36 29.25,40.75 31.05,42.55 34.4,42.55 39.33,47.48 39.33,48.28 43.02,51.98 | v49.56,58.08 49.13,58.08 43.02,51.98 | TP24.P$1 43.02,51.98
  Bottom 0.127: JP110.1 66.9,60.02 65.59,58.71 50.09,58.71 49.74,58.35 49.74,58.26 v49.56,58.08
D3_E  (via drill 0.25)
  Top 0.127: U6.14 28.75,48.75 28.02,49.48 28.02,51.81 27.4,52.43 27.25,52.43 v25.13,54.56
  Bottom 0.127: J101.9 25.15,54.54 v25.13,54.56
D3_I  (via drill 0.25)
  Top 0.127: U6.35 28.75,40.75 30.81,42.81 34.3,42.81 39.08,47.59 39.08,49.06 42.01,51.99 | v49.5,58.73 48.74,58.73 42.01,51.99 | TP23.P$1 42.01,51.99
  Bottom 0.127: JP111.1 70.81,60.38 70.62,60.56 67.09,60.56 65.5,58.97 49.76,58.97 49.52,58.73 v49.5,58.73
D4_E  (via drill 0.25)
  Top 0.127: U6.16 27.75,48.44 27.76,48.45 27.76,51.71 27.29,52.18 26.9,52.18 24.62,54.45 v24.62,55.09
  Bottom 0.127: J101.8 24.65,55.07 v24.62,55.09
D4_I
  Top 0.127: U6.33 27.75,40.75 30.06,43.06 34.19,43.06 38.82,47.7 38.82,49.83 41.99,53.01 | U7.A1 50.34,59.16 48.15,59.16 41.99,53.01 | TP27.P$1 41.99,53.01
D5_E  (via drill 0.25)
  Top 0.127: U6.17 27.25,48.3 27.51,48.56 27.51,51.6 27.19,51.92 26.73,51.92 24.14,54.52 v24.14,54.58
  Bottom 0.127: J101.7 24.15,54.57 v24.14,54.58
D5_I
  Top 0.127: U6.32 27.25,40.75 29.82,43.32 34.08,43.32 38.57,47.8 38.57,50.6 TP26.P$1 47.38,59.41 50.71,59.41 51.6,58.52 U7.A2
D6_E  (via drill 0.25)
  Top 0.127: U6.19 26.25,48.23 26,48.48 26,52.07 23.62,54.45 v23.62,55.09
  Bottom 0.127: J101.6 23.62,52.52 v23.62,55.09
D6_I
  Top 0.127: U6.30 26.25,40.75 29.07,43.57 33.98,43.57 38.31,47.91 38.31,51.36 40.73,53.77 | 40.73,53.77 46.62,59.67 50.82,59.67 51.52,58.97 53.7,58.97 53.96,58.71 53.96,58.34 53.44,57.82 52.81,57.82 U7.B2 | TP29.P$1 40.73,53.77
D7_E  (via drill 0.25)
  Top 0.127: U6.9 31.25,50.02 27.16,54.11 v27.16,54.56
  Bottom 0.127: J101.13 v27.15,54.56 v27.16,54.56
D7_I
  Top 0.127: U6.40 31.25,40.75 32.29,41.79 37.14,41.79 38.92,43.58 | 38.92,43.58 40.09,44.75 40.09,47.22 50.13,57.26 U7.B1 | TP20.P$1 38.92,43.58
D8_E  (via drill 0.25)
  Top 0.127: U6.8 31.75,48.05 31.5,48.29 31.5,50.12 27.62,54 v27.62,55.09
  Bottom 0.127: J101.14 27.65,55.07 v27.62,55.09
D8_I
  Top 0.127: U6.41 31.75,40.75 32.54,41.54 37.91,41.54 39.19,42.81 | 39.19,42.81 40.35,43.97 40.35,47.11 49.91,56.68 51.05,56.68 52.45,58.08 53.07,58.08 U7.A3 | TP17.P$1 39.19,42.81
D9_E  (via drill 0.25)
  Top 0.127: U6.6 32.75,48.06 33,48.31 33,51.56 32.75,51.81 30.17,51.81 28.16,53.83 v28.16,54.5
  Bottom 0.127: J101.15 v28.15,54.49 v28.16,54.5
D9_I
  Top 0.127: U6.43 32.75,40.75 33.28,41.28 38.63,41.28 39.92,42.58 | U7.B3 52.69,56.42 50.02,56.42 46.6,53.01 40.6,47.01 40.6,43.26 39.92,42.58 | TP18.P$1 39.92,42.58
D10_E  (via drill 0.25)
  Top 0.127: U6.5 33.25,48.2 33.25,48.21 33.25,51.76 32.95,52.07 30.28,52.07 28.66,53.69 v28.66,55.09
  Bottom 0.127: J101.16 v28.65,55.09 v28.66,55.09
D10_I
  Top 0.127: 39.94,41.56 40.85,42.48 40.85,46.9 49.42,55.47 53,55.47 U7.C3 | 39.94,41.56 39.41,41.03 33.56,41.03 33.25,40.72 U6.44 | TP15.P$1 39.94,41.56
D11_E  (via drill 0.25)
  Top 0.127: U6.3 34.25,51.22 33.15,52.32 30.38,52.32 29.16,53.55 v29.16,54.53
  Bottom 0.127: J101.17 v29.15,54.52 v29.16,54.53
D11_I
  Top 0.127: U7.C4 54.66,55.98 53.89,55.22 49.53,55.22 41.11,46.8 41.11,41.73 40.94,41.56 | U6.46 34.25,40.53 34.5,40.78 40.16,40.78 40.94,41.56 | TP16.P$1 40.94,41.56
EEPROM_WP  (via drill 0.25)
  Top 0.127: U7.M2 51.74,45.06 50.28,45.06 49.89,44.67 49.89,43.58 46.32,40 v45.94,40 | v68,7.25 J1.20
  Bottom 0.127: TP112.P$1 43.12,40 v45.94,40 43.88,37.94 43.88,37.41 42.44,35.97 42.44,33.07 51.36,24.15 51.36,11.83 55.69,7.5 67.75,7.5 v68,7.25
FLASH  (via drill 0.25)
  Top 0.127: U7.G15 68.75,51.19 69.04,51.48 70.91,51.48 71.62,50.76 v71.62,48.89 | U6.47 34.75,37.75 37,35.5 TP13.P$1 v44,35.5
  Bottom 0.127: v71.62,48.89 71.86,48.89 73.11,47.64 73.11,34.98 72.16,34.03 48.25,34.03 46.61,35.67 44.83,35.67 44.66,35.5 v44,35.5
FLASH_E  (via drill 0.25)
  Top 0.127: U6.2 34.75,53.41 v34.69,53.47
  Bottom 0.127: J101.28 34.65,53.43 v34.69,53.47
GND  (via drill 0.25, 0.35)
  Top 0.152: U3.N5 U3.P6
  Top 0.254: v57.25,21.25 U3.C4 | U3.H10 60,19.75 v59.75,20 v59,20.75 58.75,21 U3.E7 | U3.G5 58,20.25 v58.25,20 v59,19.25 59.25,19 U3.K8 | U3.P6 v58.25,16.25 | U3.N2 v56.25,16.25 | v46.44,71.12 46.33,71.24 U14.7 46.33,73.67 U14.EPAD | J1.6 v75,7.5 | J1.3 v76.5,7.5 | J1.9 v73.5,7.5
  Top 0.3: U15.16 60.44,75.2 | U15.1 60.44,75.2 | 60.44,75.2 U15.PAD | U15.6 59.14,74.55 U15.PAD | U15.7 59.14,73.9 U15.PAD | U15.9 58.49,73.25 U15.PAD | U15.11 59.79,73.9 U15.PAD | U15.12 60.44,73.25 U15.PAD
  Top 0.406: U11.2 12.82,65.51 13.31,66 C31.1
  Bottom 0.127: J100.CGND3 82.03,5.88 J100.CGND1
  Bottom 0.254: J101.34 37.65,53.34 v37.88,53.56 38.15,53.29 J101.35 38.15,53.27 v38.44,53.56 38.65,53.35 J101.36 | v21.78,51.56 21.78,51.62 21.65,51.75 J101.2 21.65,53.92 v21.73,54 | v22.03,50.94 21.65,50.94 21.15,51.44 J101.1 21.15,53.85 v21,54 | J101.19 v30.15,53.45 | J101.18 29.62,52.53 v29.62,53.73 | J101.20 v30.65,53.73
  other vias: 73,29.5 72,29.5 71,29.5 70,29.5 69,29.5 68,29.5 67,29.5 66,29.5 65,29.5 64,29.5 97.5,11.5 1,31.5 1,36.5 1,41.5 1,46.5 1,51.5 1,56.5 1,61.5 1,66.5 1,71.5 1,76.5 1,81.5 1,86.5 6.5,91.5 97.5,16.5 97.5,21.5 97.5,26.5 97.5,31.5 97.5,36.5 97.5,41.5 97.5,46.5 97.5,51.5 97.5,56.5 97.5,61.5 97.5,66.5 97.5,71.5 97.5,76.5 97.5,81.5 97.5,86.5 90,71 92.5,91.5 60.46,71.12 59.86,71.12 57.56,72.12 58.46,71.12 59.46,74.22 60.26,75.03 60.26,73.42 58.66,73.42 58.66,75.03 61.16,76.72 62.78,75.67 64,77.53 63.2,79.22 62.26,72.62 64.06,76.22 95,92 32.25,50.16 33.75,48.12 30.75,48.88 28.25,48.12 25.25,48.12 25.25,37.88 28.25,37.88 30.75,37.88 33.75,37.88 57.25,16.25 29.15,50.39 26.75,50.15 16.31,30.44 13.69,30.44 10.56,30.44 7.12,49.5 37,49.12 37.56,50.91 50.88,13.78 50.88,15.62 50.88,17.44 49.12,21.66 49.06,23 56.69,53.44 59.25,53.44 61.78,53.44 60.5,54.06 64.31,52.91 65.59,52.88 64.94,50.25 64.94,47.75 64.94,45.19 64.31,45.06 61.75,44.97 59.25,43.84 56.72,44.06 56.06,45.19 56.06,47.75 56.06,50.25 56.06,52.81 75.91,40.88 77,43.25 76,37 75.59,49.25 66.41,50.22 66.84,48.34 47,38.09 42.91,47.28 41.97,37.53 55.38,49 75.31,55.44 75.38,56.97 72.25,60.31 82.47,21.41 75.47,15.56 63.88,6.53 65.56,4.78 78.41,4.78 36,50.5 71.56,40.88 59.75,34.5 45.16,36.12 73.81,20.25 72.44,20 60.84,29.12 56.62,30.97 67,24.5 61.5,15 64,12 60.97,23.81 42.31,72 44.09,67.5 51.91,70.5 51.91,78.5 46,74 74.53,81.28 56.94,70.53 62.25,79.91 19.06,73.03 19.5,69.09 31.34,72 31.34,68 21.5,76 21.5,65.97 26.5,81.5 18,78.62 14.38,78.62 10.72,78.62 9.88,76.94 29,84 29,86 42.81,42.62 77.5,38 86,92 78,92 70,92 62,92 30.09,92.84 22,92.81 14.06,92.94 14.09,89.09 20.03,89.03 27.03,76 13.25,75.5 43.06,77.56 48.12,78.31 54,84 57.75,82.81 65.03,80.53 65.5,83.5 76,74.5 65.09,66.88 59.91,66.78 38.5,64.5 34.12,64.94 16.56,65.56 36.94,84.84 26.19,78.62 45,1.5 49.5,1.5 54,1.5 58.5,1.5 63,1.5 67.5,1.5 72,1.5 76.5,1.5 81,1.5 85.5,6 90,6 94.5,6 95.38,9.31 45,3.5 50,10.53 44.5,22 45,24 45,27 6,30 36,34.5 72,87.5 31.5,90 35.5,87.56 57.25,19.25 76.19,12.75 24.5,60.75 32.94,59.5 37.94,58.56 82.88,19.19 71.75,16.25 17.88,50 18.5,54 13,53.5 8,55.5 12,48 18.5,45.5 20.5,45.5 8.88,48 9.56,47.56 9.56,43.75 8.94,44.31 8.94,41.75 8.94,38.56 18.5,40.5 14.5,52.88 8.88,57.5 9.5,52 74.81,28.31 49,61 43.5,61 51,64 61.5,61 64.5,64.5 70,64 75.5,69 75,78 84,72 81.5,66.5 84,60 84,54 84,48 84,36 84,42 86,30 86,24 86,18 84,12 80,78 18,36 38,38 46,43 23,49 20,47.75 11,70 15,66 58,13 51,4 58,3 73,6 76,6 79,16.5 77,16.5 74,22.62 80.12,21.5 75.75,48.5 56.75,49 50.88,19.25 31.5,57.38 39.75,58.38 68.88,22.75
  pour Route15 (isolate 0.2, rank 6): -1.5,-1.5 102.5,-1.5 102.5,96.3 -1.5,96.3
  pour Top (isolate 0.2, rank 6): -0.5,-0.5 101.5,-0.5 101.5,95.3 -0.5,95.3
  pour Bottom (isolate 0.2, rank 6): 0,0 101,0 101,95 0,95
  pour Route2 (isolate 0.2, rank 6): -1,-1 102,-1 102,95.8 -1,95.8
  pour Top: 81,88 81,81.5 84,78.5 90.5,78.5 93.5,81.5 93.5,88 91,90.5 83.5,90.5
HSYNC_E  (via drill 0.25)
  Top 0.127: U6.22 24.75,52.33 22.62,54.45 v22.62,55.09
  Bottom 0.127: J101.4 22.62,52.52 v22.62,55.09
HSYNC_I  (via drill 0.25)
  Top 0.127: U6.27 24.75,41.19 v24.81,41.25 | v57.94,42 58.58,42
  Top 0.15: 58.58,42 U7.P7
  Bottom 0.127: v24.81,41.25 25.57,42.01 27.02,42.01 TP119.P$1 27.77,41.26 57.2,41.26 v57.94,42
I2C0_SCL  (via drill 0.25)
  Top 0.127: U7.C10 63.23,56.81 63.86,56.81 64.12,57.08 64.12,59.47 v64.09,59.5 | J1.18 69,9.5 67.81,10.69 v67.06,10.69
  Top 0.406: U7.C10 U7.D10
  Bottom 0.127: v64.09,59.5 65.67,59.5 66.98,60.82 76.18,60.82 80,57 80,51.88 79.12,51 TP155.P$1 78.5,39.5 84.39,33.61 84.39,16.76 79.88,12.25 69,12.25 67.44,10.69 v67.06,10.69
I2C0_SDA  (via drill 0.25)
  Top 0.127: U7.C11 63.67,56.27 64.38,56.98 64.38,58.44 64.5,58.56 64.5,58.71 64.53,58.73 v64.53,59.98 | J1.19 68.5,9.5 67.94,10.06 v67.06,10.06
  Top 0.406: U7.C11 U7.D11
  Bottom 0.127: v64.53,59.98 65.78,59.98 66.88,61.07 76.29,61.07 80.25,57.1 80.25,50.75 TP151.P$1 79.5,38.86 84.64,33.72 84.64,16.66 79.98,12 69.25,12 67.31,10.06 v67.06,10.06
I2C2_SCL  (via drill 0.25)
  Top 0.127: U9.7 15.82,51.26 16.31,51.75 20.25,51.75 20.5,51.5 R17.2 21.23,50.9 21.63,50.5 v23,50.5
  Bottom 0.127: v23,50.5 23.75,51.25 30.69,51.25 31.15,51.71 J101.21
I2C2_SDA  (via drill 0.25)
  Top 0.127: U9.6 15.18,51.24 16,52.06 20.12,52.06 20.5,52.44 R18.2 22.77,53.1 23.75,52.12 v23.75,50.5
  Bottom 0.127: J101.22 31.65,51.79 30.77,50.91 25.39,50.91 25.37,50.94 24.5,50.94 24.06,50.5 v23.75,50.5
INPUT_EN  (via drill 0.25)
  Top 0.127: v72.89,49.41 72.89,50.7 70.83,52.75 68.83,52.75 68.13,53.45 U7.E14 | v44.56,34.71 43.38,34.71 41.42,32.75 TP12.P$1 35.42,32.75 34.49,33.69 24.06,33.69 22.81,33.69 22,34.5 22,41 21.5,41.5 20.5,41.5 | R12.1 20.5,41.5 | 20.5,41.5 20.5,42.12 20.31,42.31 15.25,42.31 14.78,41.84 U5.22
  Bottom 0.127: v72.89,49.41 72.89,49.27 73.87,48.28 73.87,34.67 72.47,33.27 47.32,33.27 45.79,34.8 44.66,34.8 v44.56,34.71
IOUT  (via drill 0.35)
  Top 0.254: R50.2 v51.9,76.46 v51.91,76.47 | v48.31,76.84 46.68,76.84 46.33,76.48 U14.14
  Bottom 0.254: v51.91,76.47 48.69,76.47 v48.31,76.84
MAX4211-3V3
  Top 0.254: U16.12 30.52,82.47 TP56.1 32.5,80.5 35,80.5 37.5,78 37.5,77.5 39,76 41.97,76 42.39,75.58 42.39,74.97
  Top 0.508: U14.1 42.39,74.97 C34.1
N$1  (via drill 0.25)
  Top 0.127: 59.16,56.69 59.16,55.78 v59.25,55.69
  Top 0.305: U7.B7 59.16,56.69 60.57,56.69 U7.B9 U7.A9
  Bottom 0.127: TP171.P$1 59.31,55.62 v59.25,55.69
N$2
  Top 0.127: R5.2 D5.A
N$3  (via drill 0.25)
  Top 0.127: U7.D7 58.59,54.32 v58.01,53.74
  Bottom 0.127: TP170.P$1 58.01,54.8 v58.01,53.74
N$4  (via drill 0.25)